# EAGLE design WildfireDetectionSystem (EAGLE 9.6.2)
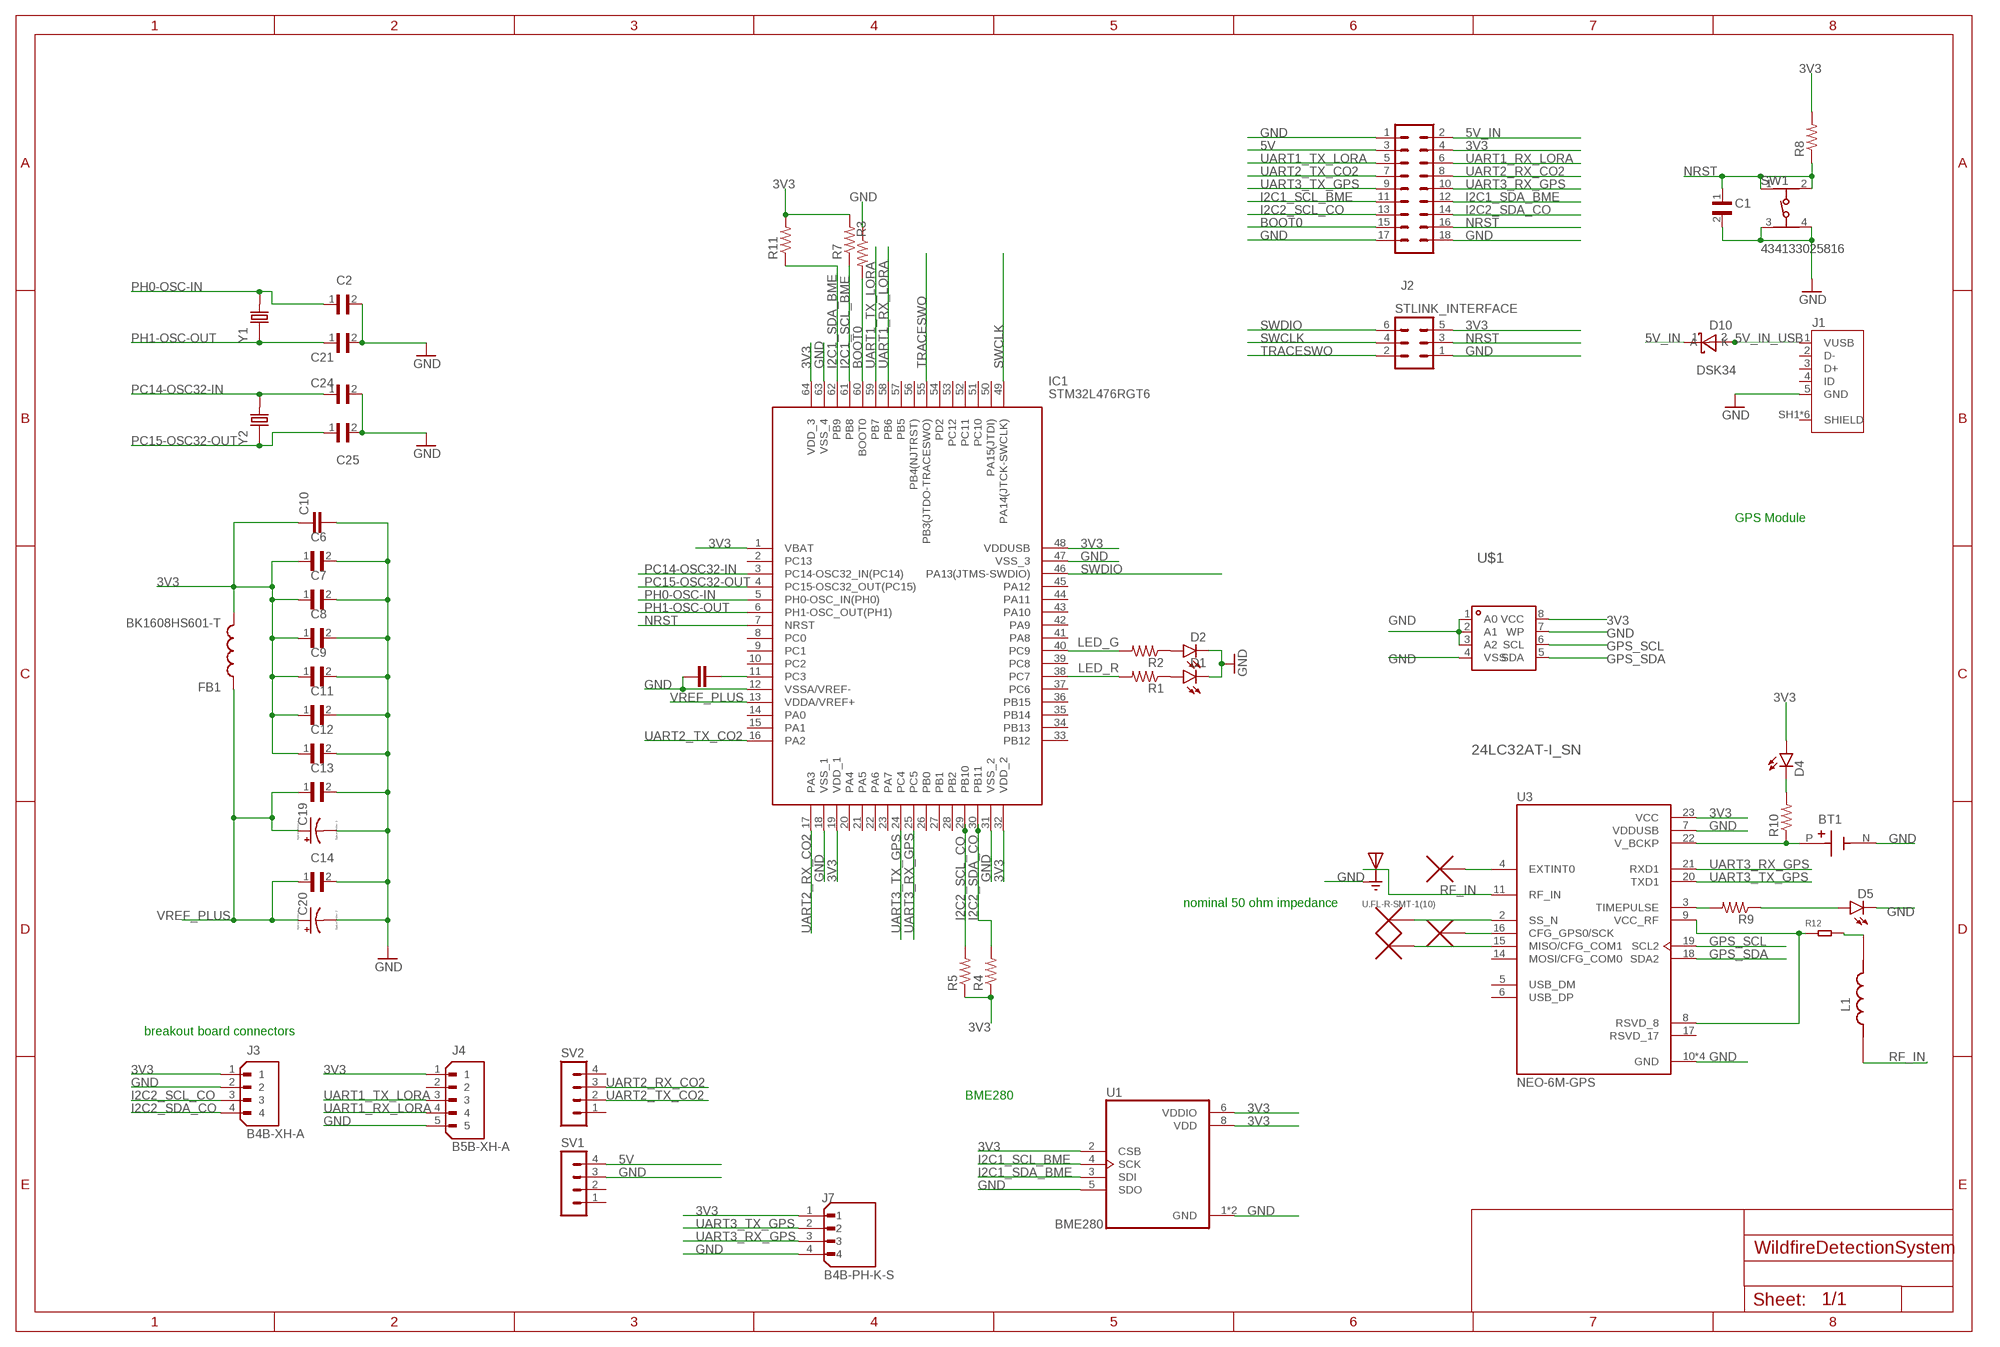
[diagram p0: schematic, sheet 1, part 1 of 2]
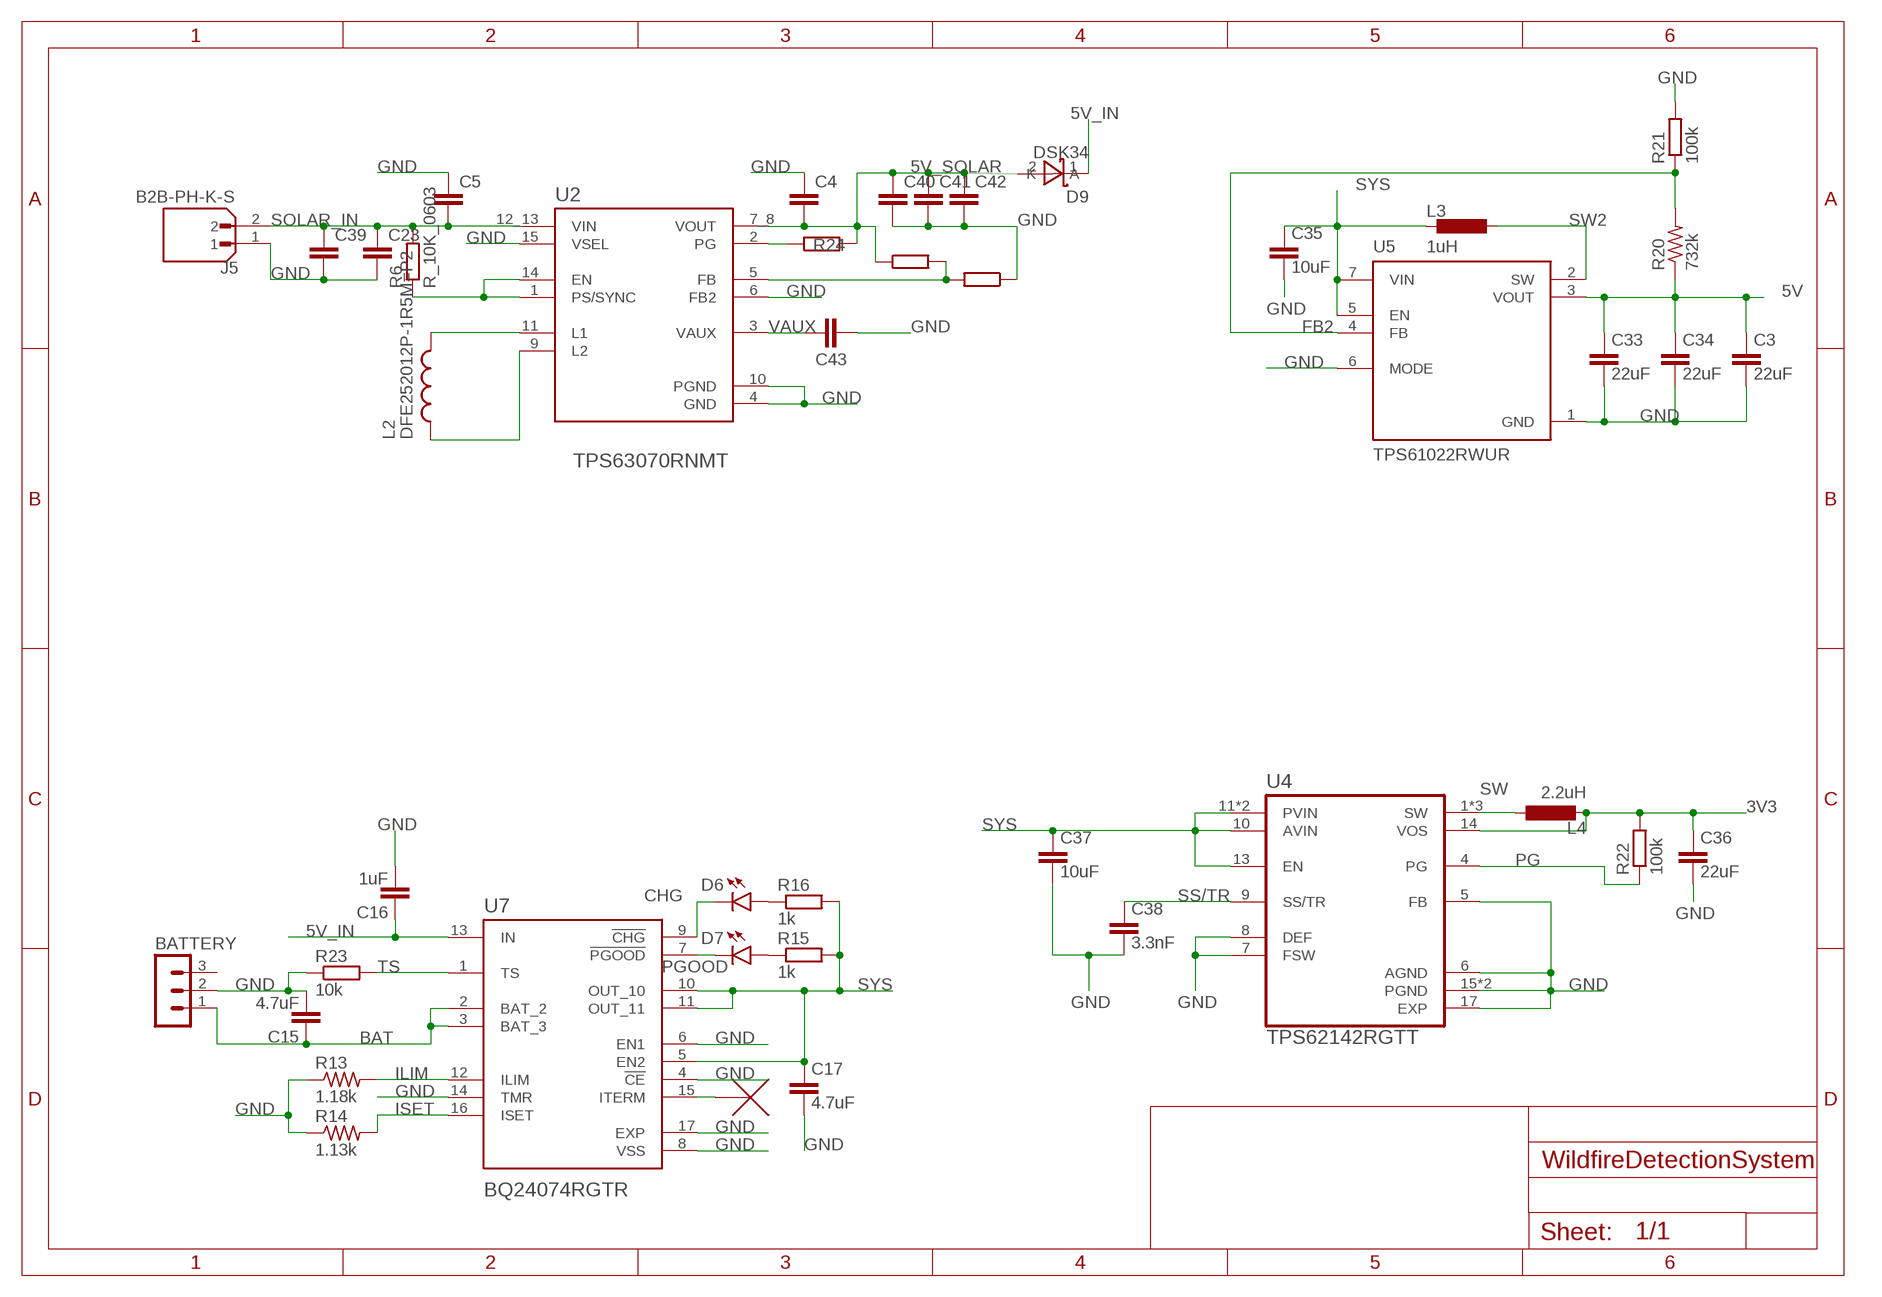
[diagram p1: schematic, sheet 1, part 2 of 2]

## Parts
BATTERY  MA03-1  [MA03-1]
BT1  1056TR  [BAT_1056TR]
C1  CL05B104KO5NNNC  [CAPC1005X55N]
C2  CL10C200JB8NNNC  [CAPC1608X90N]
C3  22uF  C_22UF/6.3V_0603  [C0603]
C4  C_10UF/10V_0603  [C0603]
C5  C_10UF/10V_0603  [C0603]
C6  CL05B104KO5NNNC  [CAPC1005X55N]
C7  CL05B104KO5NNNC  [CAPC1005X55N]
C8  CL05B104KO5NNNC  [CAPC1005X55N]
C9  CL05B104KO5NNNC  [CAPC1005X55N]
C10  CC0603KRX5R7BB105  [CAPC1608X90]
C11  CL05B104KO5NNNC  [CAPC1005X55N]
C12  CL05B104KO5NNNC  [CAPC1005X55N]
C13  CL05B104KO5NNNC  [CAPC1005X55N]
C14  CL05B104KO5NNNC  [CAPC1005X55N]
C15  4.7uF  C_4.7PF/50V_0603  [C0603]
C16  1uF  C_1UF/50V_0603  [C0603]
C17  4.7uF  C_4.7UF/16V_0603  [C0603]
C19  TAJA105K016RNJ  [CAPPM3216X180N]
C20  TAJA105K016RNJ  [CAPPM3216X180N]
C21  CL10C200JB8NNNC  [CAPC1608X90N]
C22  CC0603KRX5R7BB105  [CAPC1608X90]
C23  C_10UF/25V_0805  [C0805]
C24  CL10C200JB8NNNC  [CAPC1608X90N]
C25  CL10C200JB8NNNC  [CAPC1608X90N]
C33  22uF  C_22UF/6.3V_0603  [C0603]
C34  22uF  C_22UF/6.3V_0603  [C0603]
C35  10uF  C_10UF/10V_0603  [C0603]
C36  22uF  C_22UF/6.3V_0603  [C0603]
C37  10uF  C_10UF/10V_0603  [C0603]
C38  3.3nF  C_3.3NF/50V_0603  [C0603]
C39  C_10UF/25V_0805  [C0805]
C40  C_22UF/25V_0805  [C0805]
C41  C_22UF/25V_0805  [C0805]
C42  C_22UF/25V_0805  [C0805]
C43  C_100NF/50V_0603  [C0603]
D1  SML-P12MTT86  [LED_SML-P11UTT86R]
D2  SML-P12MTT86  [LED_SML-P11UTT86R]
D4  SML-P12VTT86  [LED_SML-P11UTT86R]
D5  SML-P12MTT86  [LED_SML-P11UTT86R]
D6  SML-P12MTT86  [LED_SML-P11UTT86R]
D7  SML-P12VTT86  [LED_SML-P11UTT86R]
D9  DSK34  [SOD-123_L2.8-W1.8-LS3.7-RD]
D10  DSK34  [SOD-123_L2.8-W1.8-LS3.7-RD]
FB1  BK1608HS601-T  [BEADC1608X95N]
IC1  STM32L476RGT6  [QFP50P1200X1200X160-64N]
J1  10118192-0001LF  [AMPHENOL_10118192-0001LF]
J2  MA09-2  [MA09-2]
J3  B4B-XH-A  [JST_B4B-XH-A]
J4  B5B-XH-A  [JST_B5B-XH-A]
J5  B2B-PH-K-S  [JST_B2B-PH-K-S]
J7  B4B-PH-K-S  [JST_B4B-PH-K-S]
J8  U.FL-R-SMT-1(10)  [HRS_U.FL-R-SMT-1(10)]
L1  MLZ2012P220WT000  [INDC2012X145N]
L2  DFE252012P-1R5M=P2  [INDC2520X120N]
L3  1uH  L_1R0_0805  [R0805]
L4  2.2uH  L_2R2_0805  [R0805]
R1  RC0402FR-071KL  [RESC1005X40N]
R2  RC0402FR-071KL  [RESC1005X40N]
R3  RC0402FR-071KL  [RESC1005X40N]
R4  RC0402FR-071KL  [RESC1005X40N]
R5  RC0402FR-071KL  [RESC1005X40N]
R6  R_10K_0603  [R0603]
R7  RT0402FRE074K7L  [RESC1005X35N]
R8  RC0402FR-0710KL  [RESC1005X40N]
R9  RC0402FR-071KL  [RESC1005X40N]
R10  RC0402FR-071KL  [RESC1005X40N]
R11  RT0402FRE074K7L  [RESC1005X35N]
R12  SMD-RES-22R-1%-1/16W(0402)  [R0402]
R13  1.18k  R-US_R0603  [R0603]
R14  1.13k  R-US_R0603  [R0603]
R15  1k  R_1K_0603  [R0603]
R16  1k  R_1K_0603  [R0603]
R20  732k  R-US_R0603  [R0603]
R21  100k  R_100K_0603  [R0603]
R22  100k  R_100K_0603  [R0603]
R23  10k  R_10K_0603  [R0603]
R24  R_100K_0603  [R0603]
R25  R_680K_0603  [R0603]
R26  R_130K_0603  [R0603]
STLINK_INTERFACE  MA03-2  [MA03-2]
SV1  MA04-1  [MA04-1]
SV2  MA04-1  [MA04-1]
SW1  434133025816  [434133025816]
U1  BME280  [PSON65P250X250X100-8N]
U2  TPS63070RNMT  [VREG_TPS63070RNMT]
U3  NEO-6M-GPS  [XCVR_NEO-6M-GPS]
U4  TPS62142RGTT  [QFN50P300X300X100-17N]
U5  TPS61022RWUR  [CONV_TPS61022RWUR]
U7  BQ24074RGTR  [QFN50P300X300X100-17N]
U$1  24LC32AT-I_SN  [SOIC-8_L4.9-W3.9-P1.27-LS6.0-BL]
U$3  NC_MARKER  (no package)
U$4  NC_MARKER  (no package)
U$5  NC_MARKER  (no package)
U$6  NC_MARKER  (no package)
U$7  NC_MARKER  (no package)
Y1  ABLS-8.000MHZ-B2-T  [XTAL_ABLS-8.000MHZ-B2-T]
Y2  ECS-.327-12.5-12QS-TR  [XTAL_ECS-.327-12.5-12QS-TR]

## Nets
3V3: C6.1 C7.1 C8.1 C9.1 C10.1 C11.1 C12.1 C36.1 D4.A FB1.2 IC1.1(VBAT) IC1.19(VDD_1) IC1.32(VDD_2) IC1.48(VDDUSB) IC1.64(VDD_3) J2.4 J3.1 J4.1 J7.1 L4.2 R4.1 R5.1 R7.2 R8.2 R11.2 R22.2 STLINK_INTERFACE.5 U1.2(CSB) U1.6(VDDIO) U1.8(VDD) U3.23(VCC) U4.14(VOS) U$1.8(VCC)
5V: C3.1 C33.1 C34.1 J2.3 R20.1 SV1.4 U5.3(VOUT)
5V_IN: C16.1 D9.1(K) D10.1(K) J2.2 U7.13(IN)
5V_IN_USB: D10.2(A) J1.1(VUSB)
5V_SOLAR: C4.2 C40.1 C41.1 C42.1 D9.2(A) R24.2 R25.1 U2.7_8(VOUT)
BAT: BATTERY.1 C15.1 U7.2(BAT_2) U7.3(BAT_3)
BOOT0: IC1.60(BOOT0) J2.15 R3.2
CHG: D6.C U7.9(!CHG)
FB2: R20.2 R21.1 U5.4(FB)
GND: BATTERY.2 BT1.N(NEG) C1.2 C2.2 C3.2 C4.1 C5.1 C6.2 C7.2 C8.2 C9.2 C10.2 C11.2 C12.2 C13.2 C14.2 C15.2 C16.2 C17.2 C19.C(-) C20.C(-) C21.2 C22.1 C23.2 C24.2 C25.2 C33.2 C34.2 C35.2 C36.2 C37.2 C38.2 C39.2 C40.2 C41.2 C42.2 C43.2 D1.C D2.C D5.C IC1.12(VSSA/VREF-) IC1.18(VSS_1) IC1.31(VSS_2) IC1.47(VSS_3) IC1.63(VSS_4) J1.5(GND) J2.1 J2.17 J2.18 J3.2 J4.5 J5.1 J7.4 J8.1(GND) J8.3(GND) R3.1 R13.1 R14.1 R21.2 R23.1 R26.1 STLINK_INTERFACE.1 SV1.3 SW1.3 SW1.4 U1.1(GND) U1.5(SDO) U1.7(GND) U2.4(GND) U2.6(FB2) U2.10(PGND) U2.15(VSEL) U3.7(VDDUSB) U3.10(GND) U3.12(GND) U3.13(GND) U3.24(GND) U4.5(FB) U4.6(AGND) U4.7(FSW) U4.8(DEF) U4.15(PGND) U4.16(PGND) U4.17(EXP) U5.1(GND) U5.6(MODE) U7.4(!CE) U7.6(EN1) U7.8(VSS) U7.14(TMR) U7.17(EXP) U$1.1(A0) U$1.2(A1) U$1.3(A2) U$1.4(VSS) U$1.7(WP)
GPS_SCL: U3.19(SCL2) U$1.6(SCL)
GPS_SDA: U3.18(SDA2) U$1.5(SDA)
I2C1_SCL_BME: IC1.61(PB8) J2.11 R7.1 U1.4(SCK)
I2C1_SDA_BME: IC1.62(PB9) J2.12 R11.1 U1.3(SDI)
I2C2_SCL_CO: IC1.29(PB10) J2.13 J3.3 R5.2
I2C2_SDA_CO: IC1.30(PB11) J2.14 J3.4 R4.2
ILIM: R13.2 U7.12(ILIM)
ISET: R14.2 U7.16(ISET)
LED_G: IC1.40(PC9) R2.2
LED_R: IC1.38(PC7) R1.2
N$2: D1.A R1.1
N$3: R9.2 U3.3(TIMEPULSE)
N$4: D2.A R2.1
N$5: U3.16(CFG_GPS0/SCK) U$3.P$1
N$6: C22.2 IC1.11(PC3)
N$7: D4.C R10.2
N$8: R12.1 U3.8(RSVD_8) U3.9(VCC_RF)
N$9: L1.2 R12.2
N$10: BT1.P(POS) R10.1 U3.22(V_BCKP)
N$11: U3.4(EXTINT0) U$4.P$1
N$12: D5.A R9.1
N$13: U3.2(SS_N) U$6.P$1
N$14: U3.15(MISO/CFG_COM1) U$7.P$1
N$17: D6.A R16.1
N$18: D7.A R15.1
N$19: L2.2 U2.11(L1)
N$20: L2.1 U2.9(L2)
N$21: R6.1 U2.1(PS/SYNC) U2.14(EN)
N$22: R24.1 U2.2(PG)
N$23: R25.2 R26.2 U2.5(FB)
N$28: U7.15(ITERM) U$5.P$1
NRST: C1.1 IC1.7(NRST) J2.16 R8.1 STLINK_INTERFACE.3 SW1.1 SW1.2
PC14-OSC32-IN: C24.1 IC1.3(PC14-OSC32_IN(PC14)) Y2.2
PC15-OSC32-OUT: C25.1 IC1.4(PC15-OSC32_OUT(PC15)) Y2.1
PG: R22.1 U4.4(PG)
PGOOD: D7.C U7.7(!PGOOD)
PH0-OSC-IN: C2.1 IC1.5(PH0-OSC_IN(PH0)) Y1.2
PH1-OSC-OUT: C21.1 IC1.6(PH1-OSC_OUT(PH1)) Y1.1
RF_IN: J8.2(SIG) L1.1 U3.11(RF_IN)
SOLAR_IN: C5.2 C23.1 C39.1 J5.2 R6.2 U2.12_13(VIN)
SS/TR: C38.1 U4.9(SS/TR)
SW: L4.1 U4.1(SW) U4.2(SW) U4.3(SW)
SW2: L3.1 U5.2(SW)
SWCLK: IC1.49(PA14(JTCK-SWCLK)) STLINK_INTERFACE.4
SWDIO: IC1.46(PA13(JTMS-SWDIO)) STLINK_INTERFACE.6
SYS: C17.1 C35.1 C37.1 L3.2 R15.2 R16.2 U4.10(AVIN) U4.11(PVIN) U4.12(PVIN) U4.13(EN) U5.5(EN) U5.7(VIN) U7.5(EN2) U7.10(OUT_10) U7.11(OUT_11)
TRACESWO: IC1.55(PB3(JTDO-TRACESWO)) STLINK_INTERFACE.2
TS: R23.2 U7.1(TS)
UART1_RX_LORA: IC1.58(PB6) J2.6 J4.4
UART1_TX_LORA: IC1.59(PB7) J2.5 J4.3
UART2_RX_CO2: IC1.17(PA3) J2.8 SV2.3
UART2_TX_CO2: IC1.16(PA2) J2.7 SV2.2
UART3_RX_GPS: IC1.25(PC5) J2.10 J7.3 U3.21(RXD1)
UART3_TX_GPS: IC1.24(PC4) J2.9 J7.2 U3.20(TXD1)
VAUX: C43.1 U2.3(VAUX)
VREF_PLUS: C13.1 C14.1 C19.A(+) C20.A(+) FB1.1 IC1.13(VDDA/VREF+)
Unconnected: BATTERY.3 IC1.2(PC13) IC1.8(PC0) IC1.9(PC1) IC1.10(PC2) IC1.14(PA0) IC1.15(PA1) IC1.20(PA4) IC1.21(PA5) IC1.22(PA6) IC1.23(PA7) IC1.26(PB0) IC1.27(PB1) IC1.28(PB2) IC1.33(PB12) IC1.34(PB13) IC1.35(PB14) IC1.36(PB15) IC1.37(PC6) IC1.39(PC8) IC1.41(PA8) IC1.42(PA9) IC1.43(PA10) IC1.44(PA11) IC1.45(PA12) IC1.50(PA15(JTDI)) IC1.51(PC10) IC1.52(PC11) IC1.53(PC12) IC1.54(PD2) IC1.56(PB4(NJTRST)) IC1.57(PB5) J1.2(D-) J1.3(D+) J1.4(ID) J1.SH1(SHIELD) J1.SH2(SHIELD) J1.SH3(SHIELD) J1.SH4(SHIELD) J1.SH5(SHIELD) J1.SH6(SHIELD) J4.2 SV1.1 SV1.2 SV2.1 SV2.4 U3.5(USB_DM) U3.6(USB_DP) U3.14(MOSI/CFG_COM0) U3.17(RSVD_17)

## Notes on the sheet
- GPS Module
- nominal 50 ohm impedance
- breakout board connectors
- BME280

## Library data of the parts
BATTERY = con-lstb:MA03-1: PIN HEADER; OC_FARNELL: unknown; OC_NEWARK: unknown
BT1 = 1056TR:1056TR: Check availability <https://pricing.snapeda.com/parts/1056TR/Keystone%20Electronics/view-part?ref=eda>; AVAILABILITY: In Stock; CHECK_PRICES: https://www.snapeda.com/parts/1056TR/Keystone/view-part/?ref=eda; DESCRIPTION: SMT Holder for 12mm Cell-on Tape & Reel | Keystone Electronics 1056TR; MF: Keystone Electronics; MP: 1056TR; PACKAGE: None; PRICE: None; SNAPEDA_LINK: https://www.snapeda.com/parts/1056TR/Keystone/view-part/?ref=snap
C1 C6-C9 C11-C14 = CL05B104KO5NNNC:CL05B104KO5NNNC; CHECK_PRICES: https://www.snapeda.com/parts/CL05B104KO5NNNC/Samsung/view-part/?ref=eda; DESCRIPTION: 0.1 µF ±10% 16V Ceramic Capacitor X7R 0402 (1005 Metric); DIGIKEY_PART_NUMBER: 1276-1001-1-ND; MF: Samsung; MP: CL05B104KO5NNNC; PACKAGE: SMD-2 Samsung; SNAPEDA_LINK: https://www.snapeda.com/parts/CL05B104KO5NNNC/Samsung/view-part/?ref=snap
C2 C21 C24 C25 = CL10C200JB8NNNC:CL10C200JB8NNNC; CHECK_PRICES: https://www.snapeda.com/parts/CL10C200JB8NNNC/Samsung/view-part/?ref=eda; DESCRIPTION: 20 pF ±5% 50V Ceramic Capacitor C0G, NP0 0603 (1608 Metric); DIGIKEY_PART_NUMBER: 1276-1187-1-ND; MF: Samsung; MP: CL10C200JB8NNNC; PACKAGE: SMD-2 Samsung; SNAPEDA_LINK: https://www.snapeda.com/parts/CL10C200JB8NNNC/Samsung/view-part/?ref=snap
C3 C33 C34 C36 = JLC PCB Basic Parts_loc:C_: Capacitor General purpose SMD Capacitor; LCSC_DATASHEET: https://datasheet.lcsc.com/lcsc/1811151138_Samsung-Electro-Mechanics-CL10A226MQ8NRNC_C59461.pdf; LCSC_PART: C59461; LCSC_ROTATION_CCW: 0; LCSC_STOCK: 6685052; PROPERTIES: 6.3V 22uF X5R ±20% 0603 ROHS
C4 C5 C35 C37 = JLC PCB Basic Parts_loc:C_: Capacitor General purpose SMD Capacitor; LCSC_DATASHEET: https://datasheet.lcsc.com/lcsc/1810191219_Samsung-Electro-Mechanics-CL10A106KP8NNNC_C19702.pdf; LCSC_PART: C19702; LCSC_ROTATION_CCW: 0; LCSC_STOCK: 2089400; PROPERTIES: 10V 10uF X5R ±10% 0603 ROHS
C10 C22 = ce-capstone:CC0603KRX5R7BB105: CAPACITOR CERAMIC, 1µF, 10V, X5R, 0603; Dielectric Characteristic:X5R; Capacitance:1µF; Capacitance Tolerance:± 10%; Voltage Rating:16V; Temperature Coefficient:± 15%; Capacitor Case Style:0603; No. of Pins:2; Mounting Type:SMD ;RoHS Compliant: Yes; DESCRIPTION: 1µF ±10% 16V Ceramic Capacitor X5R 0603 _1608 Metric_; DIGI-KEY_PART_NUMBER: 311-1444-1-ND; DIGI-KEY_PURCHASE_URL: https://www.digikey.com/product-detail/en/yageo/CC0603KRX5R7BB105/311-1444-1-ND/2833750?utm_source=snapeda&utm_medium=aggregator&utm_campaign=symbol; MF: Yageo; MP: CC0603KRX5R7BB105; PACKAGE: 0603 Yageo
C15 = JLC PCB Basic Parts_loc:C_: Capacitor General purpose SMD Capacitor; LCSC_DATASHEET: https://datasheet.lcsc.com/lcsc/1810261624_FH-Guangdong-Fenghua-Advanced-Tech-0603CG4R7C500NT_C1669.pdf; LCSC_PART: C1669; LCSC_ROTATION_CCW: 0; LCSC_STOCK: 1338830; PROPERTIES: 50V 4.7pF C0G ±0.25pF 0603 ROHS
C16 = JLC PCB Basic Parts_loc:C_: Capacitor General purpose SMD Capacitor; LCSC_DATASHEET: https://datasheet.lcsc.com/lcsc/1810261812_Samsung-Electro-Mechanics-CL10A105KB8NNNC_C15849.pdf; LCSC_PART: C15849; LCSC_ROTATION_CCW: 0; LCSC_STOCK: 14650365; PROPERTIES: 50V 1uF X5R ±10% 0603 ROHS
C17 = JLC PCB Basic Parts_loc:C_: Capacitor General purpose SMD Capacitor; LCSC_DATASHEET: https://datasheet.lcsc.com/lcsc/1810261514_Samsung-Electro-Mechanics-CL10A475KO8NNNC_C19666.pdf; LCSC_PART: C19666; LCSC_ROTATION_CCW: 0; LCSC_STOCK: 2027167; PROPERTIES: 16V 4.7uF X5R ±10% 0603 ROHS
C19 C20 = ce-capstone:TAJA105K016RNJ: Capacitor tantalum TAJ 1206 1uF 16V AVX 1uF SMD Solid MnO2 Tantalum Electrolytic Capacitor, 16 V dc +/-10%, TAJ Series Source: Datasheet <http://www.farnell.com/datasheets/1680476.pdf>; ALLIED_NUMBER: 70474975; ALLIED_PRICE-STOCK: https://www.alliedelec.com/avx-taja105k016r/70474975/; DESCRIPTION: Capacitor tantalum TAJ 1206 1uF 16V AVX 1uF SMD Solid MnO2 Tantalum Electrolytic Capacitor, 16 V dc +/-10%, TAJ Series; HEIGHT: 1.8mm; MANUFACTURER_NAME: AVX; MANUFACTURER_PART_NUMBER: TAJA105K016RNJ; MOUSER_PART_NUMBER: 581-TAJA105K016RNJ; MOUSER_PRICE-STOCK: https://www.mouser.com/Search/Refine.aspx?Keyword=581-TAJA105K016R; RS_PART_NUMBER: 6992804P; RS_PRICE-STOCK: http://uk.rs-online.com/web/p/products/6992804P
C23 C39 = JLC PCB Basic Parts_loc:C_: Capacitor General purpose SMD Capacitor; LCSC_DATASHEET: https://datasheet.lcsc.com/lcsc/1811121310_Samsung-Electro-Mechanics-CL21A106KAYNNNE_C15850.pdf; LCSC_PART: C15850; LCSC_ROTATION_CCW: 0; LCSC_STOCK: 1370441; PROPERTIES: X5R 25V ±10% 10uF 0805 ROHS
C38 = JLC PCB Basic Parts_loc:C_: Capacitor General purpose SMD Capacitor; LCSC_DATASHEET: https://datasheet.lcsc.com/lcsc/1810261513_Samsung-Electro-Mechanics-CL10B332KB8NNNC_C1613.pdf; LCSC_PART: C1613; LCSC_ROTATION_CCW: 0; LCSC_STOCK: 55111; PROPERTIES: 50V 3.3nF X7R ±10% 0603 ROHS
C40-C42 = JLC PCB Basic Parts_loc:C_: Capacitor General purpose SMD Capacitor; LCSC_DATASHEET: https://datasheet.lcsc.com/lcsc/1811151152_Samsung-Electro-Mechanics-CL21A226MAQNNNE_C45783.pdf; LCSC_PART: C45783; LCSC_ROTATION_CCW: 0; LCSC_STOCK: 1218863; PROPERTIES: X5R 25V ±20% 22uF 0805 ROHS
C43 = JLC PCB Basic Parts_loc:C_: Capacitor General purpose SMD Capacitor; LCSC_DATASHEET: https://datasheet.lcsc.com/lcsc/1809301912_YAGEO-CC0603KRX7R9BB104_C14663.pdf; LCSC_PART: C14663; LCSC_ROTATION_CCW: 0; LCSC_STOCK: 7111530; PROPERTIES: 50V 100nF X7R ±10% 0603 ROHS
D1 D2 D5 D6 = ce-capstone:SML-P12MTT86: SML-P1 Series Red 0402 Clear 60 mcd 2 V Surface Mount PICOLED LED; AVAILABILITY: Unavailable; DESCRIPTION: Green 572nm LED Indication - Discrete 2V 0402 _1006 Metric_; MF: Rohm; MP: SML-P12MTT86; PACKAGE: 0402 Rohm; PRICE: None
D4 D7 = ce-capstone:SML-P12VTT86: SML-P1 Series Red 0402 Clear 60 mcd 2 V Surface Mount PICOLED LED; AVAILABILITY: Unavailable; DESCRIPTION: Red 630nm LED Indication - Discrete 2V 0402 _1006 Metric_; MF: Rohm; MP: SML-P12VTT86; PACKAGE: 0402 Rohm; PRICE: None
D9 D10 = MDD_DSK34_LCSC_C41029:DSK34: Datasheet: https://lcsc.com/product-detail/Schottky-Barrier-Diodes-SBD_DSK34_C41029.html; MF: MDD(辰达半导体); MPN: DSK34; OC_LCSC: C41029
FB1 = ce-capstone:BK1608HS601-T: Ferrite Chip Bead(Lead Free) Source: Datasheet <https://www.tai-tech.com.tw/_upload/files/FCM1608-Series.pdf>; DESCRIPTION: Ferrite Chip Bead(Lead Free); HEIGHT: 0.95mm; MANUFACTURER_NAME: Taiyo Yuden; MANUFACTURER_PART_NUMBER: BK1608HS601-T
IC1 = STM32L476RGT6:STM32L476RGT6: ARM MCU 32-bit 80MHz 1024KB LQFP64 STMicroelectronics STM32L476RGT6, 32bit ARM Cortex M4 MCU, 80MHz, 1 MB Flash, 64-Pin LQFP Source: Datasheet <https://www.st.com/resource/en/datasheet/stm32l476je.pdf>; ARROW_PART_NUMBER: STM32L476RGT6; ARROW_PRICE-STOCK: https://www.arrow.com/en/products/stm32l476rgt6/stmicroelectronics?utm_currency=USD&region=nac; DESCRIPTION: ARM MCU 32-bit 80MHz 1024KB LQFP64 STMicroelectronics STM32L476RGT6, 32bit ARM Cortex M4 MCU, 80MHz, 1 MB Flash, 64-Pin LQFP; HEIGHT: 1.6mm; MANUFACTURER_NAME: STMicroelectronics; MANUFACTURER_PART_NUMBER: STM32L476RGT6; MOUSER_PART_NUMBER: 511-STM32L476RGT6; MOUSER_PRICE-STOCK: https://www.mouser.co.uk/ProductDetail/STMicroelectronics/STM32L476RGT6?qs=o58qnh%2FCpu44V%252B7CaDZzCA%3D%3D
J1 = ce-capstone:10118192-0001LF: Single Port 5 Contact Horizontal Right Angle Shielded Micro B USB 2.0 Connector; AVAILABILITY: Unavailable; DESCRIPTION: USB - micro B USB 2.0 Receptacle Connector 5 Position Surface Mount, Right Angle; MF: Amphenol ICC; MP: 10118192-0001LF; PACKAGE: None; PRICE: None
J2 = con-lstb:MA09-2: PIN HEADER; OC_FARNELL: unknown; OC_NEWARK: unknown
J3 = B4B-XH-A:B4B-XH-A; CHECK_PRICES: https://www.snapeda.com/parts/B4B-XH-A/JST/view-part/?ref=eda; DESCRIPTION: Conn Shrouded Header (4 Sides) HDR 4 POS 2.5mm Solder ST Top Entry Thru-Hole Box; DIGIKEY_PART_NUMBER: 455-B4B-XH-A-ND; MF: JST; MP: B4B-XH-A; PACKAGE: None; SNAPEDA_LINK: https://www.snapeda.com/parts/B4B-XH-A/JST/view-part/?ref=snap
J4 = B5B-XH-A:B5B-XH-A; CHECK_PRICES: https://www.snapeda.com/parts/B5B-XH-A/JST/view-part/?ref=eda; DESCRIPTION: JST Pin header, single-row straight 5-pin Header / Plug 5 Positions 2.5mm; DIGIKEY_PART_NUMBER: 455-B5B-XH-A-ND; MF: JST; MP: B5B-XH-A; PACKAGE: None; SNAPEDA_LINK: https://www.snapeda.com/parts/B5B-XH-A/JST/view-part/?ref=snap
J5 = B2B-PH-K-S:B2B-PH-K-S: Check availability <https://pricing.snapeda.com/parts/B2B-PH-K-S/JST%20Sales/view-part?ref=eda>; AVAILABILITY: In Stock; CHECK_PRICES: https://www.snapeda.com/parts/B2B-PH-K-S/JST/view-part/?ref=eda; DESCRIPTION: Connector Header Through Hole 2 position 0.079 (2.00mm); MF: JST Sales; MP: B2B-PH-K-S; PACKAGE: None; PRICE: None; PURCHASE-URL: https://www.snapeda.com/api/url_track_click_mouser/?unipart_id=473612&manufacturer=JST Sales&part_name=B2B-PH-K-S&search_term=b2b-ph-k-s; SNAPEDA_LINK: https://www.snapeda.com/parts/B2B-PH-K-S/JST/view-part/?ref=snap
J7 = B4B-PH-K-S:B4B-PH-K-S: Check availability <https://pricing.snapeda.com/parts/B4B-PH-K-S/JST%20Sales/view-part?ref=eda>; AVAILABILITY: In Stock; CHECK_PRICES: https://www.snapeda.com/parts/B4B-PH-K-S/JST/view-part/?ref=eda; DESCRIPTION: Connector Header Through Hole 4 position 0.079 (2.00mm); MF: JST Sales; MP: B4B-PH-K-S; PACKAGE: None; PRICE: None; PURCHASE-URL: https://www.snapeda.com/api/url_track_click_mouser/?unipart_id=515305&manufacturer=JST Sales&part_name=B4B-PH-K-S&search_term=b4b-ph-k-s; SNAPEDA_LINK: https://www.snapeda.com/parts/B4B-PH-K-S/JST/view-part/?ref=snap
J8 = U.FL-R-SMT-1_10_:U.FL-R-SMT-1(10): Check availability <https://pricing.snapeda.com/parts/U.FL-R-SMT-1%2810%29/Hirose/view-part?ref=eda>; AVAILABILITY: In Stock; CHECK_PRICES: https://www.snapeda.com/parts/U.FL-R-SMT-1(10)/Hirose+Electric+Co+Ltd/view-part/?ref=eda; DESCRIPTION: U.FL (UMCC) Connector Receptacle, Male Pin 50 Ohms Surface Mount Solder; MF: Hirose; MP: U.FL-R-SMT-1(10); PACKAGE: None; PRICE: None; PURCHASE-URL: https://www.snapeda.com/api/url_track_click_mouser/?unipart_id=55192&manufacturer=Hirose&part_name=U.FL-R-SMT-1(10)&search_term=u.fl-r-smt-1(10); SNAPEDA_LINK: https://www.snapeda.com/parts/U.FL-R-SMT-1(10)/Hirose+Electric+Co+Ltd/view-part/?ref=snap
L1 = MLZ2012P220WT000:MLZ2012P220WT000; CHECK_PRICES: https://www.snapeda.com/parts/MLZ2012P220WT000/TDK/view-part/?ref=eda; DESCRIPTION: 22 µH Shielded Multilayer Inductor 220 mA 1.25Ohm 0805 (2012 Metric); DIGIKEY_PART_NUMBER: 445-15751-1-ND; MF: TDK; MP: MLZ2012P220WT000; PACKAGE: 2012 Bourns; SNAPEDA_LINK: https://www.snapeda.com/parts/MLZ2012P220WT000/TDK/view-part/?ref=snap
L2 = DFE252012P-1R5M_P2:DFE252012P-1R5M=P2: Check availability <https://pricing.snapeda.com/parts/DFE252012P-1R5M%3DP2/Murata%20Electronics/view-part?ref=eda>; AVAILABILITY: In Stock; CHECK_PRICES: https://www.snapeda.com/parts/DFE252012P-1R5M=P2/Murata+Electronics+North+America/view-part/?ref=eda; DESCRIPTION: Inductor with Inductance: 1.5uH Tol. +/-20%, Package: 1008 (2520); MF: Murata Electronics; MP: DFE252012P-1R5M=P2; PACKAGE: 2520 Murata; PRICE: None; SNAPEDA_LINK: https://www.snapeda.com/parts/DFE252012P-1R5M=P2/Murata+Electronics+North+America/view-part/?ref=snap
L3 = JLC PCB Basic Parts_loc:L_: Inductor General purpose SMD Inductors; LCSC_DATASHEET: https://datasheet.lcsc.com/lcsc/2110081230_Sunlord-SDFL2012Q1R0KTF_C1042.pdf; LCSC_PART: C1042; LCSC_ROTATION_CCW: 0; LCSC_STOCK: 44995; PROPERTIES: ManuPN: SDFL2012Q1R0KTF 50mA 1uH ±10% 400mOhm 0805 ROHS
L4 = JLC PCB Basic Parts_loc:L_: Inductor General purpose SMD Inductors; LCSC_DATASHEET: https://datasheet.lcsc.com/lcsc/1811061719_FH-Guangdong-Fenghua-Advanced-Tech-CMI201209U2R2KT_C1043.pdf; LCSC_PART: C1043; LCSC_ROTATION_CCW: 0; LCSC_STOCK: 37908; PROPERTIES: ManuPN: CMI201209U2R2KT 50mA 2.2uH ±10% 600mOhm 0805 ROHS
R1-R5 R9 R10 = ce-capstone:RC0402FR-071KL: RES SMD 1k OHM 1% 1/16W 0402; DESCRIPTION: 510 Ohms ±1% 0.063W, 1/16W Chip Resistor 0402 _1005 Metric_ Moisture Resistant Thick Film; DIGI-KEY_PART_NUMBER: 311-510LRCT-ND; DIGI-KEY_PURCHASE_URL: https://www.digikey.com/product-detail/en/yageo/RC0402FR-07510RL/311-510LRCT-ND/729579?utm_source=snapeda&utm_medium=aggregator&utm_campaign=symbol; MF: Yageo; MP: RC0402FR-07510RL; PACKAGE: 1005 Panasonic Electronic Components
R6 R23 = JLC PCB Basic Parts_loc:R_: Resistor General purpose SMD Resistor; LCSC_DATASHEET: https://datasheet.lcsc.com/lcsc/2110260030_UNI-ROYAL-Uniroyal-Elec-0603WAF1002T5E_C25804.pdf; LCSC_PART: C25804; LCSC_ROTATION_CCW: 0; LCSC_STOCK: 7979018; PROPERTIES: ±1% 1/10W Thick Film Resistors 75V ±100ppm -55°C~+155°C 10kOhm 0603 ROHS
R7 R11 = ce-capstone:RT0402FRE074K7L: RES SMD 4.7K OHM 1% 1/16W 0402; DESCRIPTION: 4.7 kOhms ±1% 0.063W, 1/16W Chip Resistor 0402 _1005 Metric_ Thin Film; DIGI-KEY_PART_NUMBER: YAG3347CT-ND; DIGI-KEY_PURCHASE_URL: https://www.digikey.com/product-detail/en/yageo/RT0402FRE074K7L/YAG3347CT-ND/5418052?utm_source=snapeda&utm_medium=aggregator&utm_campaign=symbol; MF: Yageo; MP: RT0402FRE074K7L; PACKAGE: 1005 Yageo
R8 = ce-capstone:RC0402FR-0710KL: RES SMD 10k OHM 1% 1/16W 0402; DESCRIPTION: 510 Ohms ±1% 0.063W, 1/16W Chip Resistor 0402 _1005 Metric_ Moisture Resistant Thick Film; DIGI-KEY_PART_NUMBER: 311-510LRCT-ND; DIGI-KEY_PURCHASE_URL: https://www.digikey.com/product-detail/en/yageo/RC0402FR-07510RL/311-510LRCT-ND/729579?utm_source=snapeda&utm_medium=aggregator&utm_campaign=symbol; MF: Yageo; MP: RC0402FR-07510RL; PACKAGE: 1005 Panasonic Electronic Components
R12 = SMD-RES-22R-1_-1_16W_0402_:SMD-RES-22R-1%-1/16W(0402); CHECK_PRICES: https://www.snapeda.com/parts/RC0402FR-0722RL/Yageo/view-part/?ref=eda; DESCRIPTION: 22 Ohms ±1% 0.063W, 1/16W Chip Resistor 0402 (1005 Metric) Moisture Resistant Thick Film; DIGIKEY_PART_NUMBER: 311-22.0LRCT-ND; MF: Yageo; MP: RC0402FR-0722RL; PACKAGE: 0402 Yageo; SNAPEDA_LINK: https://www.snapeda.com/parts/RC0402FR-0722RL/Yageo/view-part/?ref=snap
R13 = rcl:R-US_: RESISTOR, American symbol; LCSC_PART: C861193; SPICEPREFIX: R
R14 = rcl:R-US_: RESISTOR, American symbol; LCSC_PART: C137782; SPICEPREFIX: R
R15 R16 = JLC PCB Basic Parts_loc:R_: Resistor General purpose SMD Resistor; LCSC_DATASHEET: https://datasheet.lcsc.com/lcsc/2110252030_UNI-ROYAL-Uniroyal-Elec-0603WAF1001T5E_C21190.pdf; LCSC_PART: C21190; LCSC_ROTATION_CCW: 0; LCSC_STOCK: 5175299; PROPERTIES: ±1% 1/10W Thick Film Resistors 75V ±100ppm -55°C~+155°C 1kOhm 0603 ROHS
R20 = rcl:R-US_: RESISTOR, American symbol; LCSC_PART: C403344; SPICEPREFIX: R
R21 R22 R24 = JLC PCB Basic Parts_loc:R_: Resistor General purpose SMD Resistor; LCSC_DATASHEET: https://datasheet.lcsc.com/lcsc/2110260030_UNI-ROYAL-Uniroyal-Elec-0603WAF1003T5E_C25803.pdf; LCSC_PART: C25803; LCSC_ROTATION_CCW: 0; LCSC_STOCK: 5826279; PROPERTIES: ±1% 1/10W Thick Film Resistors 75V ±100ppm -55°C~+155°C 100kOhm 0603 ROHS
R25 = JLC PCB Basic Parts_loc:R_: Resistor General purpose SMD Resistor; LCSC_DATASHEET: https://datasheet.lcsc.com/lcsc/2110260030_UNI-ROYAL-Uniroyal-Elec-0603WAF6803T5E_C25822.pdf; LCSC_PART: C25822; LCSC_ROTATION_CCW: 0; LCSC_STOCK: 134268; PROPERTIES: ±1% 1/10W Thick Film Resistors 75V ±100ppm -55°C~+155°C 680kOhm 0603 ROHS
R26 = JLC PCB Basic Parts_loc:R_: Resistor General purpose SMD Resistor; LCSC_DATASHEET: https://datasheet.lcsc.com/lcsc/2110252030_UNI-ROYAL-Uniroyal-Elec-0603WAF1303T5E_C22795.pdf; LCSC_PART: C22795; LCSC_ROTATION_CCW: 0; LCSC_STOCK: 107177; PROPERTIES: ±1% 1/10W Thick Film Resistors 75V ±100ppm -55°C~+155°C 130kOhm 0603 ROHS
STLINK_INTERFACE = con-lstb:MA03-2: PIN HEADER; OC_FARNELL: unknown; OC_NEWARK: unknown
SV1 SV2 = con-lstb:MA04-1: PIN HEADER; OC_FARNELL: unknown; OC_NEWARK: unknown
SW1 = 434133025816:434133025816: Check availability <https://pricing.snapeda.com/parts/434133025816/W%C3%BCrth%20Elektronik/view-part?ref=eda>; AVAILABILITY: In Stock; CHECK_PRICES: https://www.snapeda.com/parts/434133025816/W%25C3%25BCrth+Elektronik+Midcom/view-part/?ref=eda; DESCRIPTION: Tactile Switch SPST-NO Top Actuated Surface Mount; MF: Würth Elektronik; MP: 434133025816; PACKAGE: None; PRICE: None; SNAPEDA_LINK: https://www.snapeda.com/parts/434133025816/W%25C3%25BCrth+Elektronik+Midcom/view-part/?ref=snap
U1 = BME280:BME280; CHECK_PRICES: https://www.snapeda.com/parts/BME280/Bosch/view-part/?ref=eda; DESCRIPTION: Board Mount Humidity Sensors MEMS humidity, pressure and temperature sensor; DIGIKEY_PART_NUMBER: 828-1063-1-ND; MF: Bosch; MP: BME280; PACKAGE: LGA-8 Bosch; SNAPEDA_LINK: https://www.snapeda.com/parts/BME280/Bosch/view-part/?ref=snap
U2 = TPS63070RNMT:TPS63070RNMT: Check availability <https://pricing.snapeda.com/parts/TPS63070RNMT/Texas%20Instruments/view-part?ref=eda>; AVAILABILITY: In Stock; CHECK_PRICES: https://www.snapeda.com/parts/TPS63070RNMT/Texas+Instruments/view-part/?ref=eda; DESCRIPTION: Wide input voltage (2V-16V) buck-boost converter; MF: Texas Instruments; MP: TPS63070RNMT; PACKAGE: VQFN-HR-15 Texas Instruments; PRICE: None; SNAPEDA_LINK: https://www.snapeda.com/parts/TPS63070RNMT/Texas+Instruments/view-part/?ref=snap
U3 = NEO-6M-GPS:NEO-6M-GPS: Check availability <https://pricing.snapeda.com/parts/NEO-6M-GPS/u-blox/view-part?ref=eda>; AVAILABILITY: Not in stock; CHECK_PRICES: https://www.snapeda.com/parts/NEO-6M-GPS/u-blox/view-part/?ref=eda; DESCRIPTION: GPS Development Tools SparkFun GNSS-RTK Dead Reckoning Breakout - ZED-F9K (Qwiic); MF: u-blox; MP: NEO-6M-GPS; PACKAGE: None; PRICE: None; SNAPEDA_LINK: https://www.snapeda.com/parts/NEO-6M-GPS/u-blox/view-part/?ref=snap
U4 = TPS62142RGTT:TPS62142RGTT: Check availability <https://pricing.snapeda.com/parts/TPS62142RGTT/Texas%20Instruments/view-part?ref=eda>; AVAILABILITY: In Stock; CHECK_PRICES: https://www.snapeda.com/parts/TPS62142RGTT/Texas+Instruments/view-part/?ref=eda; DESCRIPTION: 3–17V 2A Step-Down Converter in 3x3 QFN package; MF: Texas Instruments; MP: TPS62142RGTT; PACKAGE: VQFN-16 Texas Instruments; PRICE: None; PURCHASE-URL: https://www.snapeda.com/api/url_track_click_mouser/?unipart_id=1002928&manufacturer=Texas Instruments&part_name=TPS62142RGTT&search_term=tps62142rgtt; SNAPEDA_LINK: https://www.snapeda.com/parts/TPS62142RGTT/Texas+Instruments/view-part/?ref=snap
U5 = TPS61022RWUR:TPS61022RWUR: Check availability <https://pricing.snapeda.com/parts/TPS61022RWUR/Texas%20Instruments/view-part?ref=eda>; AVAILABILITY: In Stock; CHECK_PRICES: https://www.snapeda.com/parts/TPS61022RWUR/Texas+Instruments/view-part/?ref=eda; DESCRIPTION: 8-A boost converter with 0.5-V ultra-low input voltage; MF: Texas Instruments; MP: TPS61022RWUR; PACKAGE: VQFN-HR-7 Texas Instruments; PRICE: None; SNAPEDA_LINK: https://www.snapeda.com/parts/TPS61022RWUR/Texas+Instruments/view-part/?ref=snap
U7 = BQ24074RGTR:BQ24074RGTR: Check availability <https://pricing.snapeda.com/parts/BQ24074RGTR/Texas%20Instruments/view-part?ref=eda>; AVAILABILITY: In Stock; CHECK_PRICES: https://www.snapeda.com/parts/BQ24074RGTR/Texas+Instruments/view-part/?ref=eda; DESCRIPTION: Standalone 1-cell 1.5-A linear battery charger, Power Path, 4.2-V VBAT, 10.5-V OVP and 4.4-V VOUT; MF: Texas Instruments; MP: BQ24074RGTR; PACKAGE: VQFN-16 Texas Instruments; PRICE: None; SNAPEDA_LINK: https://www.snapeda.com/parts/BQ24074RGTR/Texas+Instruments/view-part/?ref=snap
U$1 = MICROCHIP_24LC32AT-I_SN_LCSC_C615715:24LC32AT-I_SN: Datasheet: https://www.lcsc.com/datasheet/C615715.pdf; MF: MICROCHIP(美国微芯); MPN: 24LC32AT-I/SN; OC_LCSC: C615715
U$3-U$7 = NC_MARKER:NC_MARKER
Y1 = ce-capstone:ABLS-8.000MHZ-B2-T: Crystal 8MHz Â±20ppm (Tol) Â±50ppm (Stability) 18pF FUND 80Ohm 2-Pin HC-49/US SMD T/R; AVAILABILITY: Unavailable; DESCRIPTION: 8MHz ±20ppm Crystal 18pF 80 Ohms HC-49/US; MF: Abracon LLC; MP: ABLS-8.000MHZ-B2; PACKAGE: HC-49/US Abracon LLC; PRICE: None
Y2 = ce-capstone:ECS-.327-12.5-12QS-TR: SMD CRYSTAL 32.768 KHz; AVAILABILITY: Unavailable; DESCRIPTION: 32.768kHz ±20ppm Crystal 12.5pF 90 kOhms 2-SMD, No Lead; MF: ECS Inc.; MP: ECS-.327-12.5-12QS-TR; PACKAGE: SMD-2 ECS International; PRICE: None

## Board
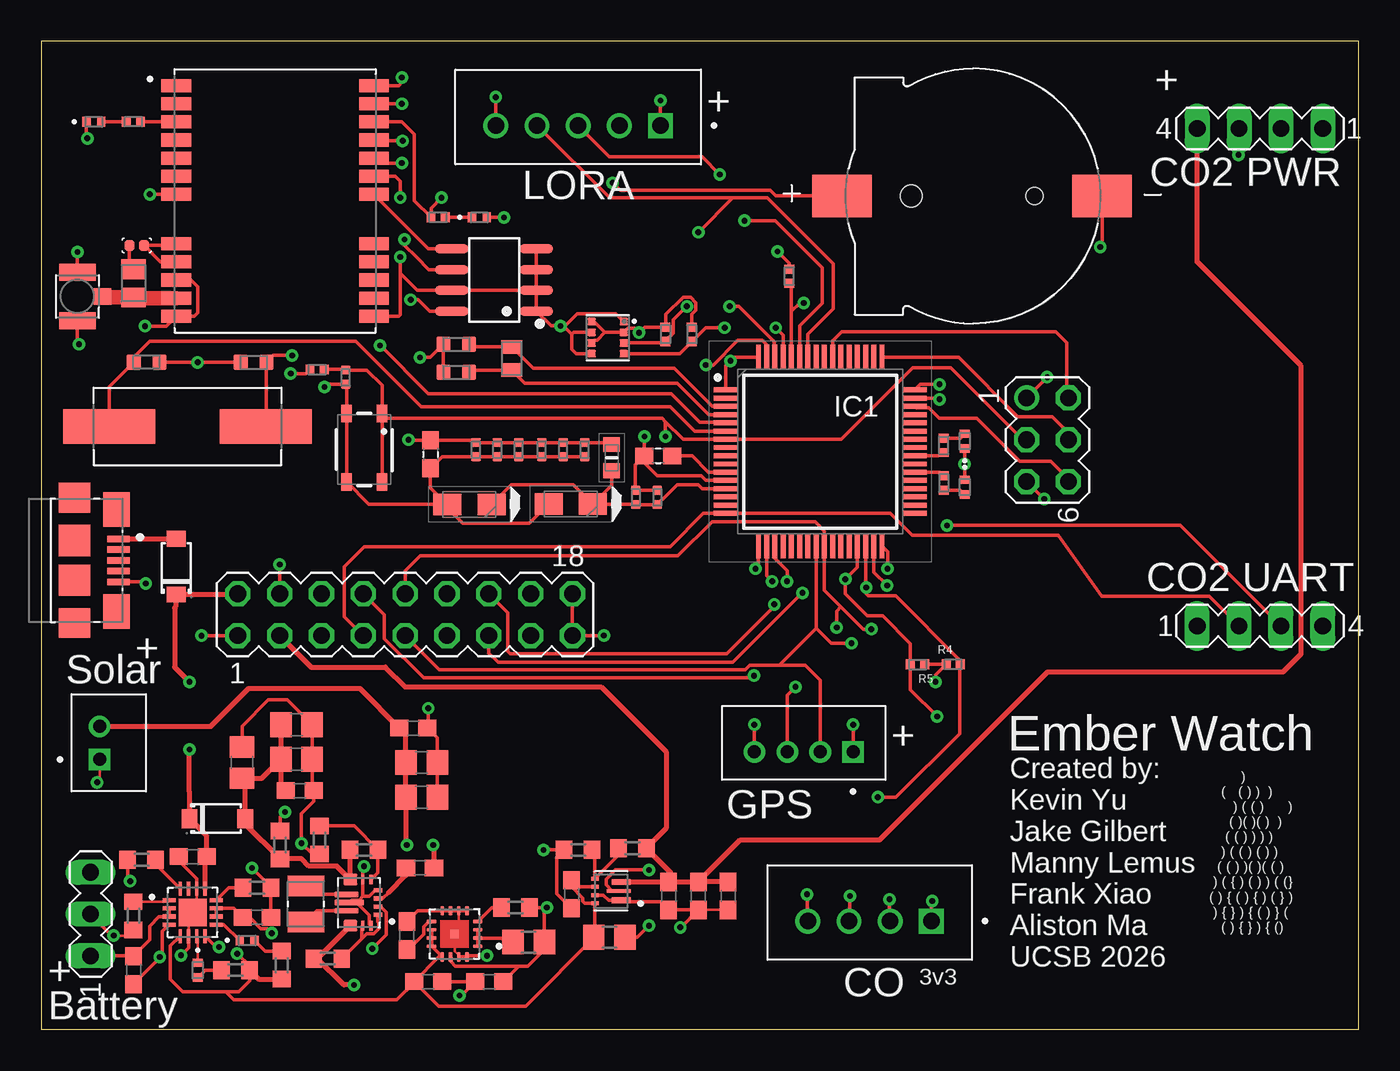
[diagram p2: board, top side]
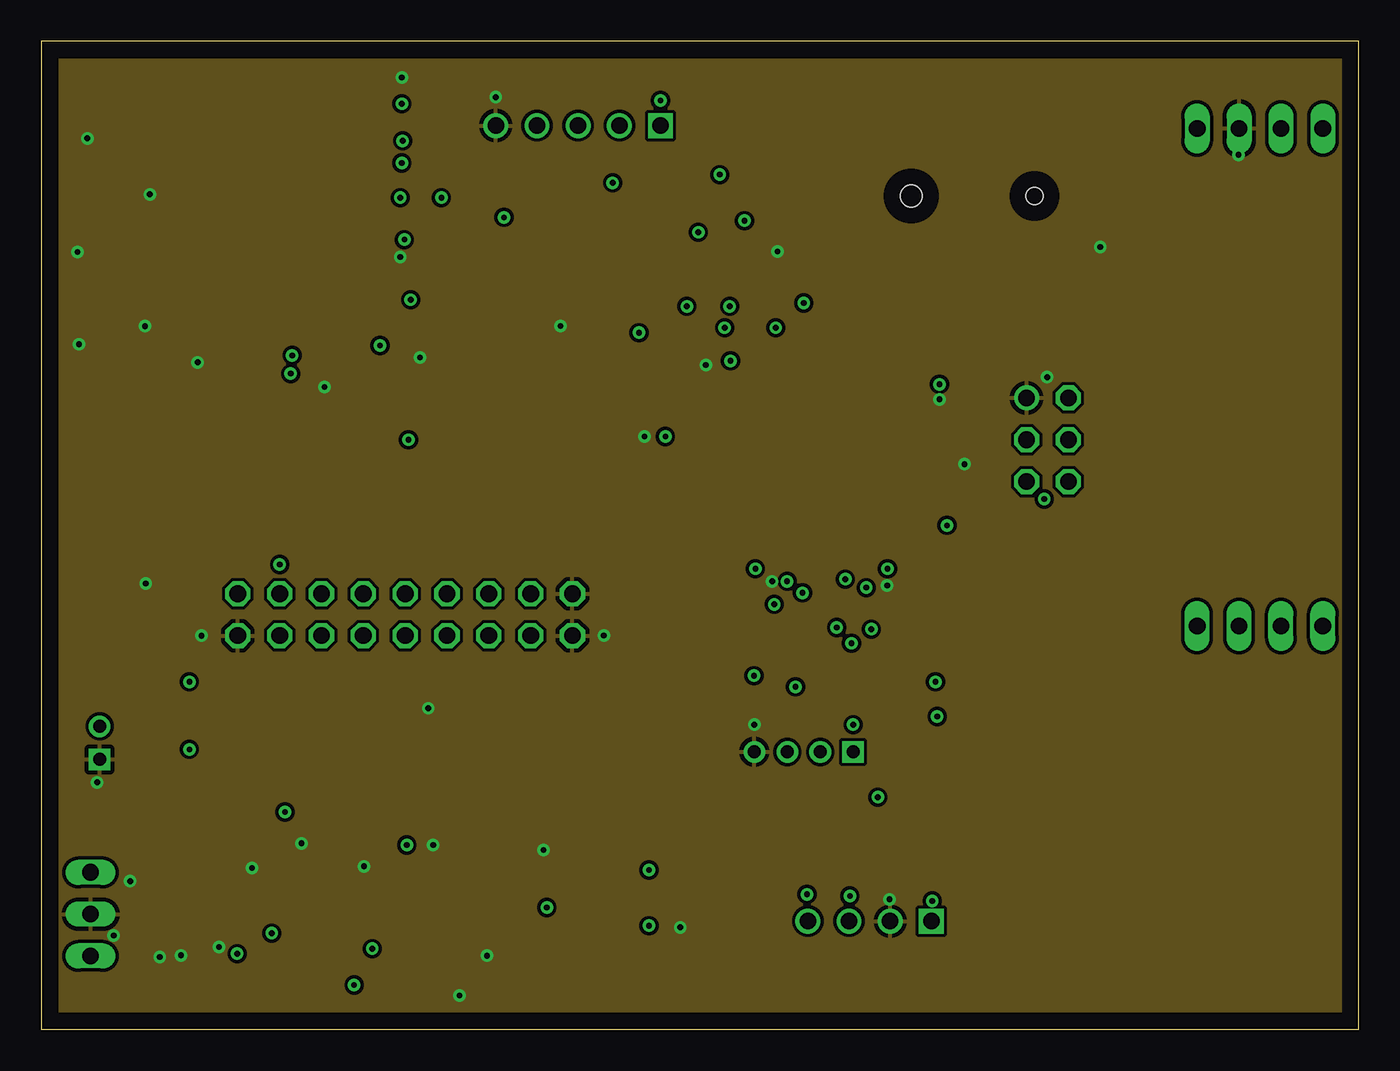
[diagram p3: board, inner layer Route2]
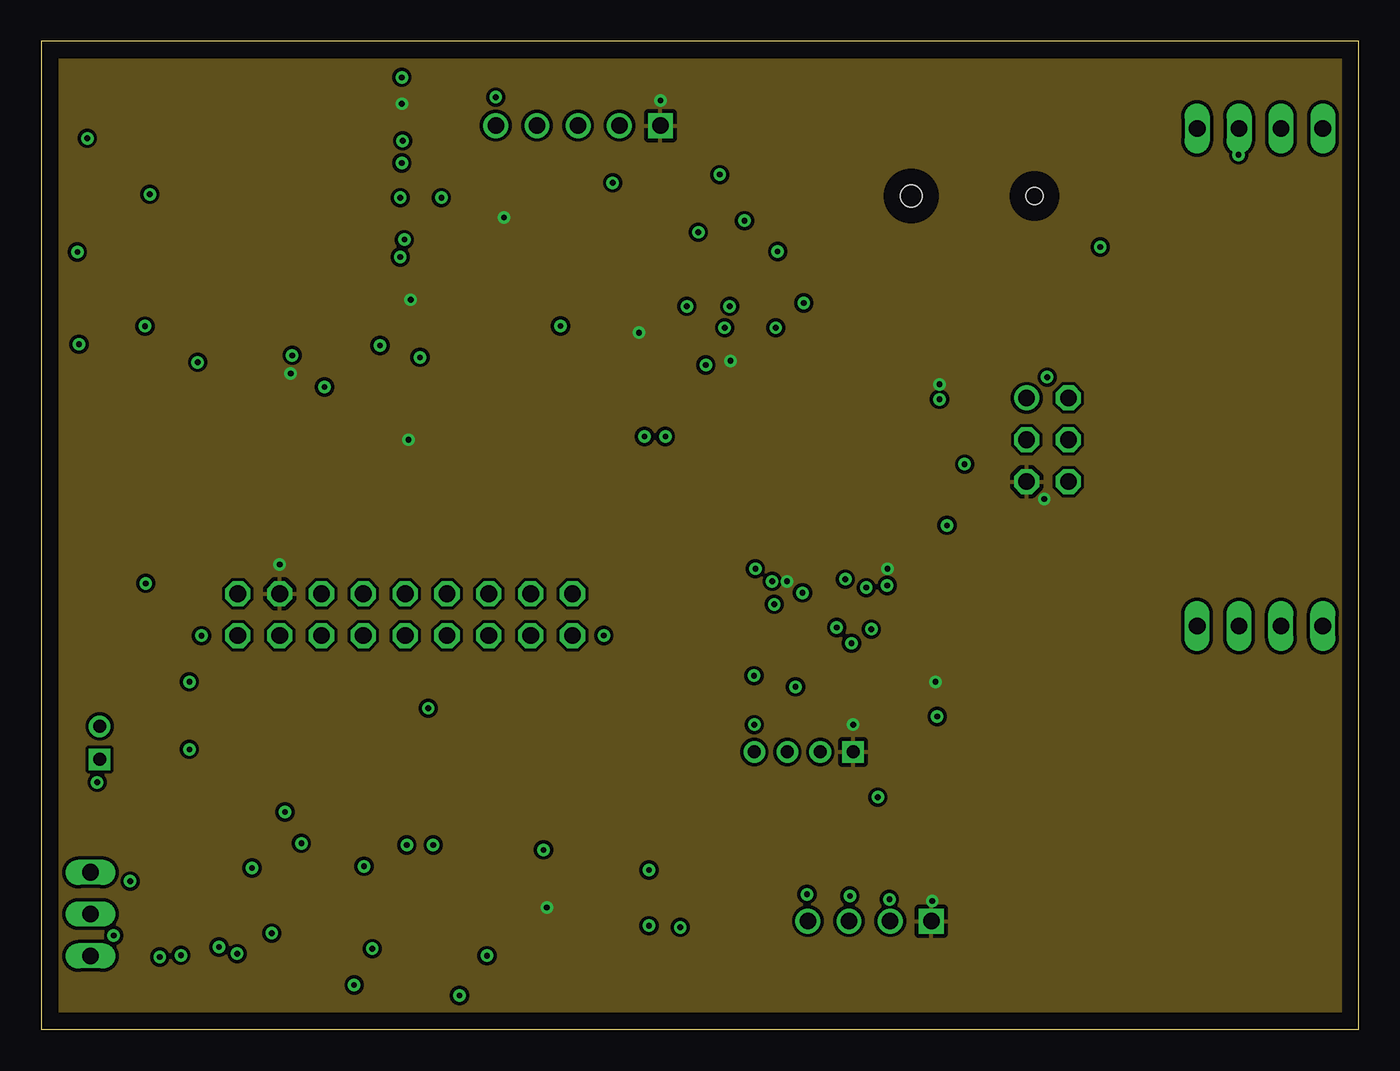
[diagram p4: board, inner layer Route15]
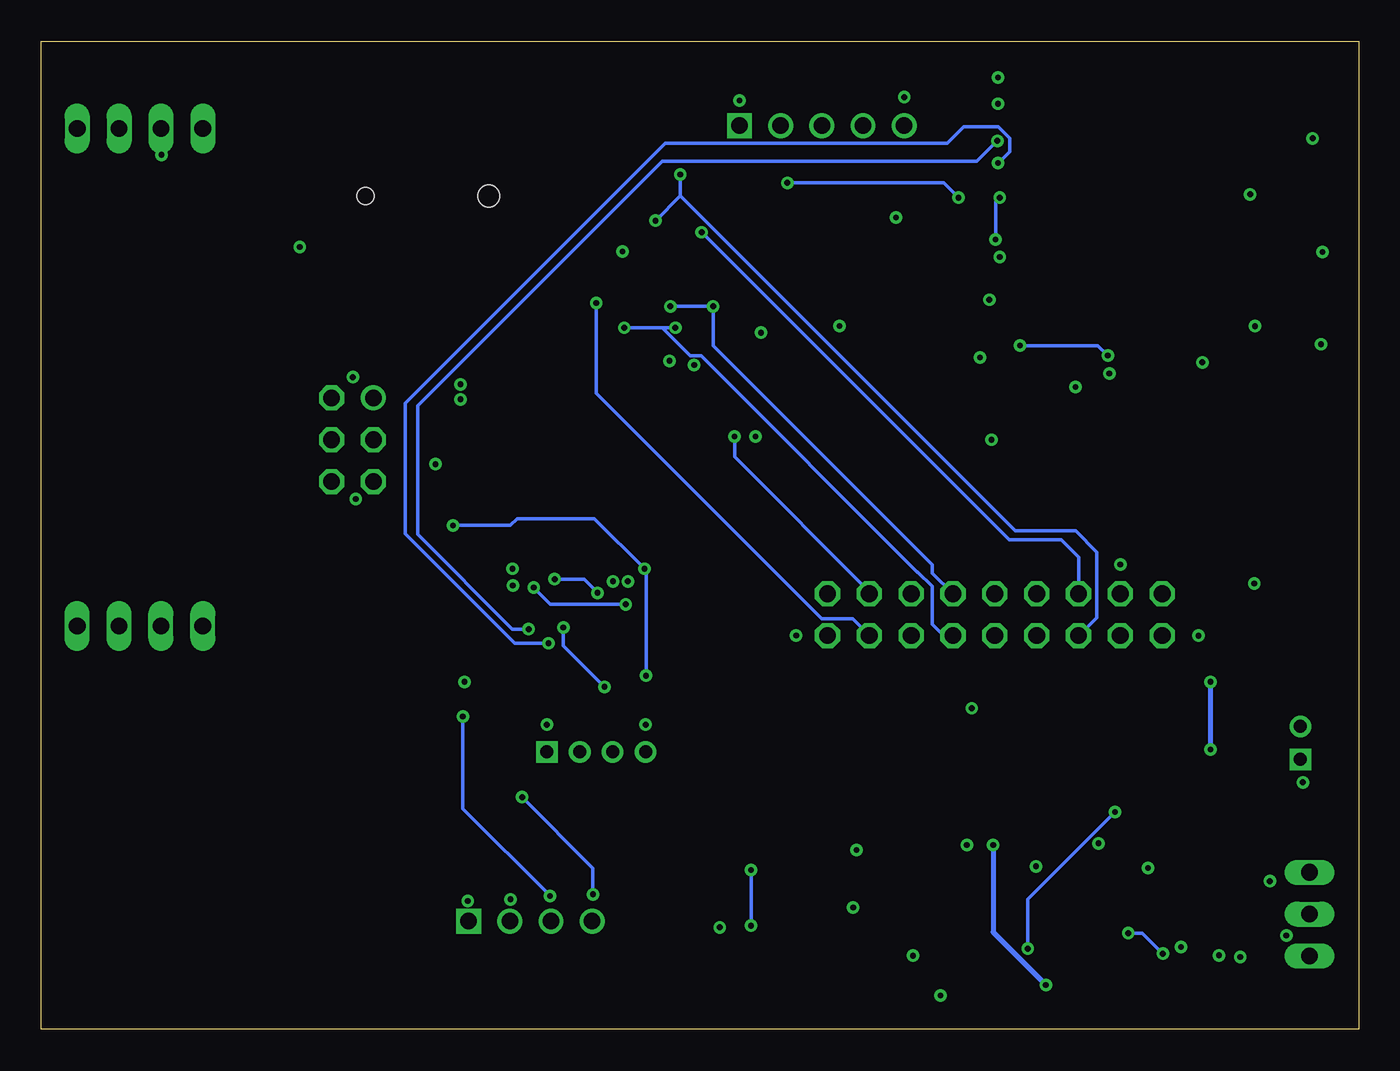
[diagram p5: board, bottom side, seen from below]

Size 80 x 60 mm. Coordinates in mm from the lower left corner, seen from the top.
Outline: 0,0 80,0 80,60 0,60 0,0
Copper layers (1+2*15+16): Top 0.035mm / dielectric 0.5mm / Route2 0.035mm / dielectric 0.15mm / Route15 0.035mm / dielectric 0.2mm / Bottom 0.035mm
Design rules "default *": minimum track width 6mil, minimum drill 0.2mm, track to track 8mil, track to pad 3mil, pad to pad 3mil, via to via 3mil, smd to smd 3mil, copper to edge 40mil, drill to drill 6mil, minimum pad ring 10mil, minimum via ring 8mil, stop-mask expansion 4mil, vias tented up to drill 0mil, thermal gap 10mil

### Footprints (pad centres in the part's own frame; a part is rotated, then mirrored left to right if it is on the bottom)
MA03-1 = drill 1.016 long: 1 -2.54,0; 2 0,0; 3 2.54,0
BAT_1056TR = smd 3.6 x 2.6: N 7.61,0; P -8.18,0 | hole 1: 3.51,0 | hole 1.3: -3.98,0
CAPC1005X55N = smd 0.54 x 0.6: 1 -0.432,0; 2 0.432,0
CAPC1608X90N = smd 0.87 x 0.93: 1 -0.78,0; 2 0.78,0
C0603 = smd 1.1 x 1: 1 -0.85,0; 2 0.85,0
CAPC1608X90 = smd 1.1 x 1: 1 -0.85,0; 2 0.85,0
CAPPM3216X180N = smd 1.7 x 1.3: A -1.35,0; C 1.35,0
C0805 = smd 1.3 x 1.5: 1 -0.95,0; 2 0.95,0
LED_SML-P11UTT86R = smd 0.5 x 0.6: A 0.45,0; C -0.45,0
SOD-123_L2.8-W1.8-LS3.7-RD = smd 0.95 x 1.15: 1 -1.692,0; 2 1.692,0
BEADC1608X95N = smd 0.9 x 1: 1 -0.8,0; 2 0.8,0
QFP50P1200X1200X160-64N = smd 1.475 x 0.3: 1 -5.738,3.75; 2 -5.738,3.25; 3 -5.738,2.75; 4 -5.738,2.25; 5 -5.738,1.75; 6 -5.738,1.25; 7 -5.738,0.75; 8 -5.738,0.25; 9 -5.738,-0.25; 10 -5.738,-0.75; 11 -5.738,-1.25; 12 -5.738,-1.75; 13 -5.738,-2.25; 14 -5.738,-2.75; 15 -5.738,-3.25; 16 -5.738,-3.75; 33 5.738,-3.75; 34 5.738,-3.25; 35 5.738,-2.75; 36 5.738,-2.25; 37 5.738,-1.75; 38 5.738,-1.25; 39 5.738,-0.75; 40 5.738,-0.25; 41 5.738,0.25; 42 5.738,0.75; 43 5.738,1.25; 44 5.738,1.75; 45 5.738,2.25; 46 5.738,2.75; 47 5.738,3.25; 48 5.738,3.75 | smd 0.3 x 1.475: 17 -3.75,-5.738; 18 -3.25,-5.738; 19 -2.75,-5.738; 20 -2.25,-5.738; 21 -1.75,-5.738; 22 -1.25,-5.738; 23 -0.75,-5.738; 24 -0.25,-5.738; 25 0.25,-5.738; 26 0.75,-5.738; 27 1.25,-5.738; 28 1.75,-5.738; 29 2.25,-5.738; 30 2.75,-5.738; 31 3.25,-5.738; 32 3.75,-5.738; 49 3.75,5.738; 50 3.25,5.738; 51 2.75,5.738; 52 2.25,5.738; 53 1.75,5.738; 54 1.25,5.738; 55 0.75,5.738; 56 0.25,5.738; 57 -0.25,5.738; 58 -0.75,5.738; 59 -1.25,5.738; 60 -1.75,5.738; 61 -2.25,5.738; 62 -2.75,5.738; 63 -3.25,5.738; 64 -3.75,5.738
AMPHENOL_10118192-0001LF = smd 0.4 x 1.35: 1 -1.3,0; 2 -0.65,0; 3 0,0; 4 0.65,0; 5 1.3,0 | smd 2.1 x 1.6: SH1 -3.1,-0.125; SH2 3.1,-0.125 | smd 1.8 x 1.9: SH3 -3.8,-2.675; SH6 3.8,-2.675 | smd 1.9 x 1.9: SH4 -1.2,-2.675; SH5 1.2,-2.675
MA09-2 = drill 1.016 octagon: 1 -10.16,-1.27; 2 -10.16,1.27; 3 -7.62,-1.27; 4 -7.62,1.27; 5 -5.08,-1.27; 6 -5.08,1.27; 7 -2.54,-1.27; 8 -2.54,1.27; 9 0,-1.27; 10 0,1.27; 11 2.54,-1.27; 12 2.54,1.27; 13 5.08,-1.27; 14 5.08,1.27; 15 7.62,-1.27; 16 7.62,1.27; 17 10.16,-1.27; 18 10.16,1.27
JST_B4B-XH-A = drill 1 square: 1 3.75,-0.525 | drill 1: 2 1.25,-0.525; 3 -1.25,-0.525; 4 -3.75,-0.525
JST_B5B-XH-A = drill 1 square: 1 5,-0.525 | drill 1: 2 2.5,-0.525; 3 0,-0.525; 4 -2.5,-0.525; 5 -5,-0.525
JST_B2B-PH-K-S = drill 0.8 square: 1 1,-0.55 | drill 0.8: 2 -1,-0.55
JST_B4B-PH-K-S = drill 0.8 square: 1 3,-0.55 | drill 0.8: 2 1,-0.55; 3 -1,-0.55; 4 -3,-0.55
HRS_U.FL-R-SMT-1(10) = smd 1.05 x 2.2: 1 -1.475,0; 3 1.475,0 | smd 1 x 1.05: 2 0,-1.525
INDC2012X145N = smd 1.2 x 1.47: 1 -0.86,0; 2 0.86,0
INDC2520X120N = smd 1.24 x 2.22: 1 -1.09,0; 2 1.09,0
R0805 = smd 1.3 x 1.5: 1 -0.95,0; 2 0.95,0
RESC1005X40N = smd 0.54 x 0.6: 1 -0.432,0; 2 0.432,0
R0603 = smd 1 x 1.1: 1 -0.85,0; 2 0.85,0
RESC1005X35N = smd 0.56 x 0.6: 1 -0.435,0; 2 0.435,0
R0402 = smd 0.635 x 0.635: 1 0,0.445; 2 0,-0.445
MA03-2 = drill 1.016: 1 -2.54,-1.27 | drill 1.016 octagon: 2 -2.54,1.27; 3 0,-1.27; 4 0,1.27; 5 2.54,-1.27; 6 2.54,1.27
MA04-1 = drill 1.016 long: 1 -3.81,0; 2 -1.27,0; 3 1.27,0; 4 3.81,0
434133025816 = smd 1.05 x 0.65: 1 -2.075,1.075; 2 2.075,1.075; 3 -2.075,-1.075; 4 2.075,-1.075
PSON65P250X250X100-8N = smd 0.49 x 0.45: 1 0.97,0.975; 2 0.97,0.325; 3 0.97,-0.325; 4 0.97,-0.975; 5 -0.97,-0.975; 6 -0.97,-0.325; 7 -0.97,0.325; 8 -0.97,0.975
VREG_TPS63070RNMT = smd 0.6 x 0.25: 1 -1.15,0.75; 2 -1.15,0.25; 3 -1.15,-0.25; 4 -1.15,-0.75 | smd 0.25 x 0.6: 5 -0.725,-1.4; 6 -0.225,-1.4; 14 -0.225,1.4; 15 -0.725,1.4 | smd 0.85 x 0.7: 7_8 0.525,-1.4; 12_13 0.525,1.4 | smd 1.45 x 0.35: 9 0.775,-0.5; 11 0.775,0.5 | smd 1.8 x 0.35: 10 0.6,0
XCVR_NEO-6M-GPS = smd 1.8 x 0.8: 1 -6,7; 2 -6,5.9; 3 -6,4.8; 4 -6,3.7; 5 -6,2.6; 6 -6,1.5; 7 -6,0.4; 8 -6,-2.6; 9 -6,-3.7; 10 -6,-4.8; 11 -6,-5.9; 12 -6,-7; 13 6,-7; 14 6,-5.9; 15 6,-4.8; 16 6,-3.7; 17 6,-2.6; 18 6,0.4; 19 6,1.5; 20 6,2.6; 21 6,3.7; 22 6,4.8; 23 6,5.9; 24 6,7
QFN50P300X300X100-17N = smd 0.6 x 0.24: 1 -1.4,0.75; 2 -1.4,0.25; 3 -1.4,-0.25; 4 -1.4,-0.75; 9 1.4,-0.75; 10 1.4,-0.25; 11 1.4,0.25; 12 1.4,0.75 | smd 0.24 x 0.6: 5 -0.75,-1.4; 6 -0.25,-1.4; 7 0.25,-1.4; 8 0.75,-1.4; 13 0.75,1.4; 14 0.25,1.4; 15 -0.25,1.4; 16 -0.75,1.4 | smd 0.5 x 0.5: 17 0,0
CONV_TPS61022RWUR = smd 1.15 x 0.35: 1 -0.625,0.55; 3 -0.625,-0.55 | smd 1.45 x 0.2: 2 -0.475,0 | smd 0.45 x 0.25: 4 0.975,-0.75; 5 0.975,-0.25; 6 0.975,0.25; 7 0.975,0.75
QFN50P300X300X100-17N' = smd 0.86 x 0.26: 1 -1.435,0.75; 2 -1.435,0.25; 3 -1.435,-0.25; 4 -1.435,-0.75; 9 1.435,-0.75; 10 1.435,-0.25; 11 1.435,0.25; 12 1.435,0.75 | smd 0.26 x 0.86: 5 -0.75,-1.435; 6 -0.25,-1.435; 7 0.25,-1.435; 8 0.75,-1.435; 13 0.75,1.435; 14 0.25,1.435; 15 -0.25,1.435; 16 -0.75,1.435 | smd 1.68 x 1.68: 17 0,0
SOIC-8_L4.9-W3.9-P1.27-LS6.0-BL = smd 0.588 x 2.045: 1 -1.905,-2.57; 2 -0.635,-2.57; 3 0.635,-2.57; 4 1.905,-2.57; 5 1.905,2.57; 6 0.635,2.57; 7 -0.635,2.57; 8 -1.905,2.57
XTAL_ABLS-8.000MHZ-B2-T = smd 5.6 x 2.1: 1 -4.75,0; 2 4.75,0
XTAL_ECS-.327-12.5-12QS-TR = smd 0.8 x 1.3: 1 -0.7,0; 2 0.7,0

### Placement (x,y rotation side)
BATTERY  3,7 90 top
BT1  56.8,50.6 0 top
C1  18.5,39.6 270 top
C2  12.9,40.5 180 top
C3  41.7,8.1 270 top
C4  15.7,14.5 180 top
C5  22.6,18.3 180 top
C6  30.4,35.2 270 top
C7  31.7,35.2 270 top
C8  33,35.2 270 top
C9  26.4,35.2 270 top
C10  23.64,34.92 270 top
C11  27.7,35.2 270 top
C12  29,35.2 270 top
C13  37.4,32.3 90 top
C14  36.1,32.3 90 top
C15  5.6,3.6 270 top
C16  9.2,10.5 180 top
C17  13.1,6.8 0 top
C19  25.99,31.88 180 top
C20  32.15,31.9 180 top
C21  6.4,40.5 0 top
C22  37.47,34.83 0 top
C23  23.1,14.1 0 top
C24  25.2,41.6 180 top
C25  25.2,39.9 180 top
C33  39.9,8.1 270 top
C34  38.1,8.1 270 top
C35  32.2,8.2 270 top
C36  27.2,2.9 180 top
C37  23.5,2.9 0 top
C38  22.2,5.7 90 top
C39  23.1,16.2 0 top
C40  15.5,16.4 0 top
C41  12.2,16.2 90 top
C42  15.5,18.5 0 top
C43  23,9.8 0 top
D1  56.06,32.92 270 top
D2  56.06,35.72 90 top
D4  26.6,49.3 0 top
D5  3.2,55.1 0 top
D6  12.5,5.4 0 top
D7  9.5,3.6 270 top
D9  10.7,12.8 0 top
D10  8.2,28.1 90 top
FB1  34.64,34.71 90 top
IC1  47.3,35.08 0 top
J1  4.7,28.48 270 top
J2  22.1,25.18 0 top
J3  50.3,7.1 0 top
J4  32.6,55.4 0 top
J5  4.1,17.4 270 top
J7  46.3,17.4 0 top
J8  2.2,44.5 90 top
L1  5.6,45.3 90 top
L2  16.07,7.62 270 top
L3  34.5,5.6 180 top
L4  29.6,5.3 0 top
R1  54.79,33.17 90 top
R2  54.79,35.46 270 top
R3  45.41,45.73 270 top
R4  55.38,22.16 0 top
R5  53.21,22.16 180 top
R6  17.4,4.3 180 top
R7  39.5,42.2 90 top
R8  16.75,40.07 180 top
R9  5.6,55.1 0 top
R10  24.1,49.3 0 top
R11  37.9,42.2 90 top
R12  5.8,47.6 270 top
R13  13.1,8.6 180 top
R14  6.1,10.3 0 top
R15  11.8,3.6 0 top
R16  14.6,3.9 270 top
R20  35.9,11 180 top
R21  32.6,10.9 180 top
R22  28.8,7.4 0 top
R23  5.6,6.9 90 top
R24  14.5,11.2 270 top
R25  19.6,10.9 0 top
R26  16.9,11.5 90 top
STLINK_INTERFACE  61.1,35.8 270 top
SV1  74,54.7 180 top
SV2  74,24.5 0 top
SW1  19.62,35.31 270 top
U1  34.4,42 0 top
U2  19.3,7.7 180 top
U3  14.2,50.3 0 top
U4  25.1,5.8 180 top
U5  34.6,8.4 180 top
U7  BQ24074RGTR  [QFN50P300X300X100-17N']  9.2,7.1 0 top
U$1  27.5,45.5 90 top
Y1  8.89,36.61 0 top
Y2  28.57,40.73 90 top

### Tracks (layer width: path | path; a pad name or v marks a point on that pad's centre or on a via)
3V3  (via drill 0.35)
  Top 0.203: IC1.48 53.37,39.16 v54.54,39.16 | J2.4 v14.48,28.23 | IC1.32 51.38,29.01 v51.38,27.97 | IC1.1 41.56,40.3 v41.86,40.59 42.08,40.82 IC1.64 | v45.29,27.21 45.29,27.86 44.55,28.59 IC1.19 | U1.6 33.6,41.85 33.75,41.85 34.23,42.33 | 34.23,42.33 U1.2 35.62,42.57 36.03,42.57 v36.3,42.3 36.63,42.64 R11.2 37.92,42.66 37.92,43.41 38.97,44.46 39.43,44.46 39.76,44.13 39.76,43.67 39.5,43.41 R7.2 | U1.8 33.58,42.98 34.23,42.33 | D4.A v28.1,49.3 | U3.23 v21.9,56.2 | J4.1 v37.6,56.4 | v60.9,32.2 STLINK_INTERFACE.5 | U4.14 24.89,4.36 24.89,4.11 25.16,3.85 29,3.85 | 29,3.85 29.55,3.85 30.55,4.85 L4.2 30.55,7.25 v30.7,7.4 R22.2 | C36.1 29,3.85 | J7.1 v49.3,18.5 | R5.1 R4.1 54.3,21.52 v54.3,21.1 | J3.1 54.05,7.75 v54.1,7.8 | R8.2 16.07,39.82 v15.14,39.82 | FB1.2 34.52,35.63 C8.1 C7.1 C6.1 C12.1 C11.1 C9.1 26.27,35.77 C10.1 22.33,35.77 v22.3,35.8 | U$1.8 23.61,43.59 22.9,44.3 v22.43,44.3
  pour Route15: 1,59 79,59 79,1 1,1
5V
  Top 0.203: C34.1 38.2,8.95
  Top 0.305: U5.3 C34.1 | C33.1 38.2,8.95 38.2,9.55 R20.1 37.95,12.2 37.95,16.85 34,20.8 22.1,20.8 20.9,22 16.39,22 J2.3 | C33.1 42.45,11.5 50.9,11.5 61.1,21.7 75.4,21.7 76.5,22.8 76.5,40.29 70.19,46.6 SV1.4 | C3.1 C33.1
5V_IN  (via drill 0.35)
  Top 0.305: v9,17 9,14.41 9.01,14.41 D9.1 10.05,11.76 C16.1 9.95,10.4 U7.13 | v9,21.1 8.1,22 8.1,25.6 8.2,25.7 D10.1 11.89,26.41 J2.2
  Bottom 0.305: v9,17 v9,21.1
5V_IN_USB
  Top 0.305: D10.2 8.14,29.78 J1.1
5V_SOLAR
  Top 0.305: C42.1 C40.1 | C40.1 14.55,14.8 C4.2 | R25.1 18.77,10.88 U2.7_8 17.95,9.92 16.25,9.92 15.83,10.35 R24.2 12.39,12.46 D9.2 12.39,15.16 12.3,15.25 | C41.1 12.3,15.25 | 12.3,15.25 13.4,15.25 C40.1
BAT
  Top 0.152: 6.59,5.44 6.59,5.5
  Top 0.203: U7.2 U7.3 7.75,6.83 7.15,6.83 6.59,6.28 6.59,5.5 | BATTERY.1 C15.1 6.59,5.44
BOOT0  (via drill 0.35)
  Top 0.203: IC1.60 45.55,43.6 | 45.55,43.6 45.55,45.16 R3.2 | 45.55,43.6 46.05,44.1 v46.3,44.1
  Bottom 0.203: J2.15 30.73,24.93 32.6,24.93 46.3,38.63 v46.3,44.1
CHG
  Top 0.203: U7.9 11.1,6.35 D6.C
FB2
  Top 0.203: R20.2 35.05,10.57 U5.4 33.62,10.72 R21.1
GND  (via drill 0.35)
  Top 0.152: R23.1 5.25,5.7 v4.4,5.7 | U4.6 25.35,6.05 U4.17 25.1,4.76 25.32,4.54 25.32,4.43 U4.15 | U7.14 9.45,7.35 U7.17 8.95,6.85 U7.6 | C33.2 C3.2 | J5.1 3.55,15.15 v3.4,15
  Top 0.203: J1.5 6.25,27.18 v6.35,27.08 | J2.18 J2.17 v34.16,23.91 | D1.C v56.06,34.32 D2.C | IC1.47 54.47,38.33 v54.54,38.25 | IC1.31 50.55,27.77 v51.37,26.95 | IC1.63 44.05,41.56 43.78,41.84 42.3,41.84 40.8,40.34 v40.36,40.34 | IC1.12 40.36,33.33 40.08,33.61 37.41,33.61 36.62,34.41 C22.1 | R3.1 45.41,46.53 v44.71,47.23 | C22.1 v36.63,36 | U1.1 34.89,43.45 32.55,43.45 31.81,42.71 31.81,42.59 | U1.5 32.48,41.02 32.2,41.3 32.2,42.2 | U1.7 32.33,42.33 32.2,42.2 | 32.2,42.2 31.81,42.59 | U3.24 21.7,57.3 21.9,57.5 v21.9,57.8 | J4.5 v27.6,56.6 | J4.5 | J3.2 51.5,6.62 v51.5,7.9 | D5.C 2.75,54.15 v2.8,54.1 | v6.3,42.7 7.6,42.7 U3.12 9.3,43.3 9.5,43.5 9.5,45.1 9.1,45.5 U3.10 | U3.13 21.7,43.3 21.8,43.4 21.8,45.9 | 21.8,45.9 v21.8,46.9 | U3.7 v6.6,50.7 | C22.1 36.08,34.29 36.08,32.75 C14.2 C13.2 | IC1.18 44.05,27.54 v44.38,27.21 | 31.81,42.59 31.69,42.71 v31.53,42.71 30.96,42.71 U$1.1 U$1.2 | SV1.3 72.73,53.13 v72.7,53.1 | 21.8,45.9 22.84,44.86 U$1.7 U$1.2 | C2.2 v9.5,40.5 C21.2 | C25.2 C24.2 23.62,40.8 v23,40.8 | C8.2 C7.2 C6.2 C12.2 C11.2 C9.2 24.34,34.77 C10.2 23.64,32.89 C19.C | J8.3 v2.2,47.2 | J8.1 2.2,41.7 v2.3,41.6 | v61.08,39.6 59.83,38.35 STLINK_INTERFACE.1 | v9.74,23.91 J2.1 | U7.4 7.37,5.95 7.37,4.56 v7.2,4.4 7.2,4.35 C15.2 | v4.4,5.7 4.3,5.7 BATTERY.2 | R14.1 5.25,9.15 v5.4,9 | v12.8,9.8 13.95,8.65 R13.1 C17.2 | U4.15 U4.16 25.93,4.48 v27.07,4.48 | U4.5 U4.6 U4.7 U4.8 22.85,7.2 C38.2 | C37.2 C36.2 25.51,2.06 v25.4,2.06 | U5.6 34.14,8.15 34.45,7.85 U5.1 35.33,7.75 37.6,7.75 C34.2 C33.2 38.85,6.2 v38.8,6.2 | v30.5,10.9 R21.2 31.3,10.45 31.3,8.25 C35.2 | J7.4 v43.3,18.5 | U7.6 8.95,4.97 v8.48,4.5 | U7.8 10.62,5 v10.8,5 | v17.2,39 17.37,39.17 C1.2 18.5,39.16 18.55,39.11 SW1.3 SW1.4 19.9,31.88 C19.C
  Top 0.203: BT1.N 64.41,47.61 v64.3,47.5 | C20.C 29.64,30.73 25.6,30.73 24.64,31.69 C19.C | U2.10 18.85,7.85 19.3,7.85 | 19.3,7.85 19.52,8.07 | 19.52,8.07 U2.6 19.52,9.82 v19.6,9.9 | U2.4 20.3,8.45 19.92,8.07 19.52,8.07 | U2.15 19.93,6.4 19.93,6.92 19.3,7.55 19.3,7.85 | C23.2 C39.2 24.05,17.7 C5.1 23.5,18.35 v23.5,19.5 | U7.14 9.45,9.15 8.35,10.25 C16.2 | R26.1 16.45,10.65 v15.8,11.3 15.8,13.1 16.55,13.85 C4.1 16.45,14.6 C40.2 C42.2 14.95,20 13.8,20 12.2,18.4 C41.2 | U$1.4 U$1.3 U$1.2
  Top 0.305: C43.2 23.85,11.15 v23.8,11.2
  pour Route2: 1,59 79,59 79,1 1,1
GPS_SCL  (via drill 0.35)
  Top 0.203: v21.8,50.5 21.8,51.5 21.5,51.8 U3.19 | v22.05,47.95 22.05,47.62 22.8,46.87 23.54,46.14 U$1.6
  Bottom 0.203: v22.05,47.95 22.05,50.25 v21.8,50.5
GPS_SDA
  Top 0.203: U3.18 23.5,47.41 U$1.5
I2C1_SCL_BME  (via drill 0.35)
  Top 0.203: U1.4 38.76,41.02 R7.1 40.34,42.6 v41.5,42.6 | v44.6,42.6 45.05,42.15 IC1.61
  Bottom 0.203: v41.5,42.6 42.3,42.6 | 42.3,42.6 v44.6,42.6 | 42.3,42.6 40.59,40.89 39.93,40.89 26.8,27.76 26.77,27.76 25.9,26.89 25.9,24.6 25.21,23.91 J2.11
I2C1_SDA_BME  (via drill 0.35)
  Top 0.203: U1.3 37.81,41.67 R11.1 37.9,41.8 38.38,42.28 38.38,43.08 v39.2,43.9 | IC1.62 44.51,40.86 44.51,41.75 42.36,43.9 v41.8,43.9
  Bottom 0.203: v41.8,43.9 v39.2,43.9 39.2,41.5 26,28.3 25.99,28.3 25.89,28.2 25.89,27.7 J2.12
I2C2_SCL_CO  (via drill 0.35)
  Top 0.203: J2.13 27.18,22.85 27.74,22.29 42,22.29 v46.22,26.51 | IC1.29 49.55,28.06 v48.83,27.33 48.83,26.44 50.17,25.1 51.1,25.1 52.78,23.42 R5.2 52.78,20.62 v54.4,19 | v49.1,8.1 49.1,6.62 J3.3
  Bottom 0.203: v46.22,26.51 47.04,27.33 v48.83,27.33 | v54.4,19 54.4,13.4 v49.1,8.1
I2C2_SDA_CO  (via drill 0.35)
  Top 0.203: J2.14 28.32,25.31 28.32,22.96 28.48,22.8 41.62,22.8 44.51,25.68 v44.51,25.81 | IC1.30 50.05,26.87 v50.09,26.82 50.09,26.44 50.22,26.32 51.88,26.32 55.81,22.39 R4.2 55.76,22.11 55.76,17.96 51.9,14.1 v50.8,14.1 | v46.5,8.2 46.5,6.62 J3.4
  Bottom 0.203: v44.51,25.81 49.08,25.81 v50.09,26.82 | v50.8,14.1 46.5,9.8 v46.5,8.2
ILIM
  Top 0.203: U7.12 11.38,8.6 R13.2
ISET
  Top 0.203: U7.16 6.95,10.04 R14.2
LED_G
  Top 0.203: R2.2 54.67,35.03 54.46,34.83 IC1.40
LED_R
  Top 0.203: IC1.38 54.57,33.83 R1.2
N$2
  Top 0.203: R1.1 55.79,32.74 D1.A
N$3
  Top 0.203: U3.3 R9.2
N$4
  Top 0.203: R2.1 55.66,35.89 55.66,35.9 55.8,35.9 D2.A
N$6
  Top 0.203: IC1.11 40.51,33.83 39.52,34.83 C22.2
N$7
  Top 0.203: D4.C R10.2
N$8
  Top 0.203: U3.8 8.1,47.6 R12.1 7.25,46.6 U3.9
N$9
  Top 0.203: L1.2 5.36,46.4 R12.2
N$10  (via drill 0.35)
  Top 0.203: U3.22 21.9,55.1 22.65,54.35 22.65,50.32 R10.1 23.67,49.87 v24.3,50.5 | BT1.P 44.61,50.6 44.27,50.94 35.16,50.94 v34.7,51.4
  Bottom 0.203: v34.7,51.4 25.2,51.4 v24.3,50.5
N$12
  Top 0.203: D5.A R9.1
N$17
  Top 0.203: R16.1 13.6,4.75 D6.A
N$18
  Top 0.203: D7.A 9.9,3.55 9.96,3.6 R15.1
N$19
  Top 0.203: U2.11 16.74,7.2 L2.2
N$20
  Top 0.203: U2.9 16.58,8.2 L2.1
N$21
  Top 0.203: R6.1 19.45,5.5 | 19.45,5.5 19.45,6.23 U2.14 | U2.1 20.45,6.52 20.48,6.49 20.48,6.1 20.2,5.82 19.77,5.82 19.45,5.5
N$22  (via drill 0.35)
  Top 0.203: R24.1 14.5,12.9 v14.8,13.2 | U2.2 20.49,7.41 20.65,7.41 20.94,7.12 20.94,5.74 v20.1,4.9
  Bottom 0.203: v14.8,13.2 20.1,7.9 v20.1,4.9
N$23
  Top 0.203: U2.5 20.45,9.53 R25.2 19,12.35 R26.2
NRST  (via drill 0.35)
  Top 0.203: SW1.1 SW1.2 | STLINK_INTERFACE.3 59.6,35.8 55.22,40.18 52.92,40.18 48.58,35.83 IC1.7 38.97,35.83 37.9,36.9 | R8.1 18.46,40.07 C1.1 19.77,40.03 20.7,39.11 SW1.1 | SW1.1 20.98,37.1 37.7,37.1 37.9,36.9 | v37.9,36 37.9,36.9
  Bottom 0.203: J2.16 29.72,26.58 37.9,34.76 v37.9,36
PC14-OSC32-IN
  Top 0.203: IC1.3 40.73,37.83 38.43,40.14 29.87,40.14 Y2.2 26.14,41.44 C24.1
PC15-OSC32-OUT
  Top 0.203: IC1.4 40.53,37.33 38.62,39.23 29.37,39.23 Y2.1 26.11,40.03 C25.1
PG
  Top 0.203: U4.4 27.35,7.4 R22.1
PGOOD
  Top 0.152: U7.7 9.5,5.62 D7.C
PH0-OSC-IN  (via drill 0.35)
  Top 0.203: IC1.5 41.53,36.86 40,36.86 38.26,38.6 23.5,38.6 v20.57,41.53 | v15.24,40.92 14.1,40.92 C2.1 13.68,36.65 Y1.2
  Bottom 0.203: v20.57,41.53 v20.57,41.52 15.84,41.52 v15.24,40.92
PH1-OSC-OUT
  Top 0.203: Y1.1 4.14,39.02 C21.1 5.62,40.8 6.6,41.78 19.1,41.78 23.08,37.8 38.2,37.8 39.68,36.33 IC1.6
RF_IN
  Top 0.203: L1.1 5.6,44.4 | 3.79,44.44 J8.2
  Top 0.89: U3.11 5.6,44.4 | L1.1 3.79,44.44
SOLAR_IN  (via drill 0.35)
  Top 0.305: R6.2 16.77,4.3 | 16.77,4.3 U2.12_13 | v19,2.7 18.38,2.7 16.77,4.3 | J5.2 10.3,18.4 12.6,20.7 19.35,20.7 C5.2 22.15,17.9 C39.1 C23.1 22.15,11.25 v22.2,11.2
  Bottom 0.305: v22.2,11.2 22.2,5.9 v19,2.7
SS/TR
  Top 0.203: C38.1 22.3,4.85 23.22,5.77 23.22,6.22 23.51,6.51 23.66,6.51 U4.9
SW
  Top 0.203: U4.2 27.95,5.55 28.2,5.3 L4.1 | U4.1 U4.2 | U4.3 U4.2
SW2  (via drill 0.35)
  Top 0.203: U5.2 35.08,8.42 34.65,8.42 34.3,8.77 34.3,9.13 34.85,9.68 v36.9,9.68 | v36.9,6.3 36.2,5.6 L3.1
  Bottom 0.203: v36.9,9.68 v36.9,6.3
SWCLK
  Top 0.203: IC1.49 51.07,40.8 55.7,40.8 59.3,37.2 61.4,37.2 62.37,36.23 STLINK_INTERFACE.4
SWDIO
  Top 0.203: IC1.46 53.13,37.73 53.88,37.73 54.52,37.1 56.8,37.1 59.4,34.5 61.3,34.5 62.37,33.43 STLINK_INTERFACE.6
SYS  (via drill 0.35)
  Top 0.203: U7.10 U7.11 11.7,7.35 C17.1 12.65,6.8 13.33,6.12 13.72,6.12 v14,5.85 | U7.5 7.85,5.06 7.85,3.05 8.6,2.3 11.2,2.3 | U4.10 U4.11 U4.12 U4.13 24.15,4.4 C37.1 22.68,2.88 | 33.62,5.62 U5.7 33,7.65 32.88,7.77 32.88,7.97 32.2,8.65 C35.1 32.6,8.65 U5.5 | 33.62,5.62 L3.2 | 22.68,2.88 24.15,1.4 29.41,1.4 33.62,5.62 | 11.2,2.3 11.7,1.8 21.6,1.8 22.68,2.88 | 11.2,2.3 12,2.3 12.65,2.95 R15.2 12.65,3.85 v11.9,4.6
  Top 0.305: R15.2 13.2,3.05 R16.2
  Bottom 0.203: v11.9,4.6 13.15,5.85 v14,5.85
TRACESWO
  Top 0.203: IC1.55 48.05,41.8 48.62,42.37 61.6,42.37 62.27,41.7 62.27,38.44 STLINK_INTERFACE.2
TS
  Top 0.152: U7.1 7.7,7.78 7.59,7.78 7.55,7.75 R23.2
UART1_RX_LORA  (via drill 0.35)
  Top 0.203: IC1.58 46.55,42.22 48.08,43.75 48.08,46.48 44.08,50.48 42,50.48 | 42,50.48 34.52,50.48 30.12,54.88 J4.4 | 42,50.48 39.92,48.4 v39.9,48.4
  Bottom 0.203: v39.9,48.4 21.22,29.72 18.07,29.72 17.02,28.66 J2.6
UART1_TX_LORA  (via drill 0.35)
  Top 0.203: IC1.59 46.05,42.72 47.43,44.1 47.43,46.23 44.56,49.1 v42.7,49.1 | v41.2,51.9 40.12,52.98 34.5,52.98 J4.3
  Bottom 0.203: v42.7,49.1 41.2,50.6 | v41.2,51.9 41.2,50.6 | 41.2,50.6 20.87,30.27 17.19,30.27 15.9,28.98 15.9,25 16.99,23.91 J2.5
UART2_RX_CO2  (via drill 0.35)
  Top 0.203: J2.8 20.83,25.18 20.83,23.73 23.22,21.34 43.14,21.34 v43.28,21.48 | v43.36,27.97 43.55,28.16 IC1.17 | v55,30.6 69.17,30.6 SV2.3
  Bottom 0.203: v43.28,21.48 43.28,27.88 v43.36,27.97 46.41,31.02 51.1,31.02 51.52,30.6 v55,30.6
UART2_TX_CO2
  Top 0.203: J2.7 18.41,25.05 18.41,28.1 19.62,29.31 38.19,29.31 40.21,31.33 IC1.16 51.56,31.33 52.89,30 61.74,30 64.4,26.3 70.93,26.3 SV2.2
UART3_RX_GPS  (via drill 0.35)
  Top 0.203: J2.10 22.1,27.85 23,28.76 38.66,28.76 40.73,30.83 46.98,30.83 47.55,30.26 IC1.25 47.55,26.65 48.55,25.65 | 48.55,25.65 49.9,24.3 v50.4,24.3 | v21.95,53.95 20.25,53.95 U3.21 | 48.55,25.65 48.3,25.4 v48.3,24.4 | v45.8,20.8 45.3,20.3 J7.3
  Bottom 0.203: v21.95,53.95 23.2,52.7 42.3,52.7 57.15,37.85 57.15,30.05 51.4,24.3 v50.4,24.3 | v48.3,24.4 48.3,23.3 v45.8,20.8
UART3_TX_GPS  (via drill 0.35)
  Top 0.203: J2.9 22.1,23.9 24.17,21.83 42.73,21.83 43.02,22.11 44.81,22.11 | v21.9,52.6 20.5,52.6 U3.20 | IC1.24 47.05,24.35 | 47.05,24.35 47.96,23.44 v49.2,23.44 | 44.81,22.11 47.05,24.35 | J7.2 47.3,21.2 46.39,22.11 44.81,22.11
  Bottom 0.203: v21.9,52.6 21.2,53.3 21.2,54.1 21.9,54.8 24,54.8 25,53.8 42.1,53.8 57.89,38.01 57.89,30.09 51.24,23.44 v49.2,23.44
VAUX
  Top 0.203: 21.1,8.3 20.75,7.95 U2.3
  Top 0.305: 21.1,8.3 22.15,9.35 C43.1
VREF_PLUS
  Top 0.203: IC1.13 40.13,32.83 39.89,33.08 38.63,33.08 37.77,32.21 37.74,32.21 C13.1 C14.1 36.07,31.9 C20.A | C20.A 32.32,33.08 28.54,33.08 C19.A | FB1.1 34.64,33.04 C20.A

### Text on the board
tPlace: + | + | CO2 PWR | LORA | CO2 UART | + | Solar | + | Ember Watch | GPS | Created by: / Kevin Yu / Jake Gilbert / Manny Lemus / Frank Xiao / Aliston Ma / UCSB 2026 | ) / ( ( ) ) ) / ) ( ( ) ) / ( )( )( ) ) / ( ( ) ) ) ) / ) ( ( ) ( ) ) / ( ( ) )( )( ( ) / ) ( { ) ( ) ) ( (} / ( ) { ( ) { ) ( } ) / ) { } ) { ( ) } ( / ( ) { } ) { () | + | 3v3 | CO | Battery